# EAGLE board Sequencer-Logic-Prod-V2.0 (EAGLE 9.6.2), part 1 of 2
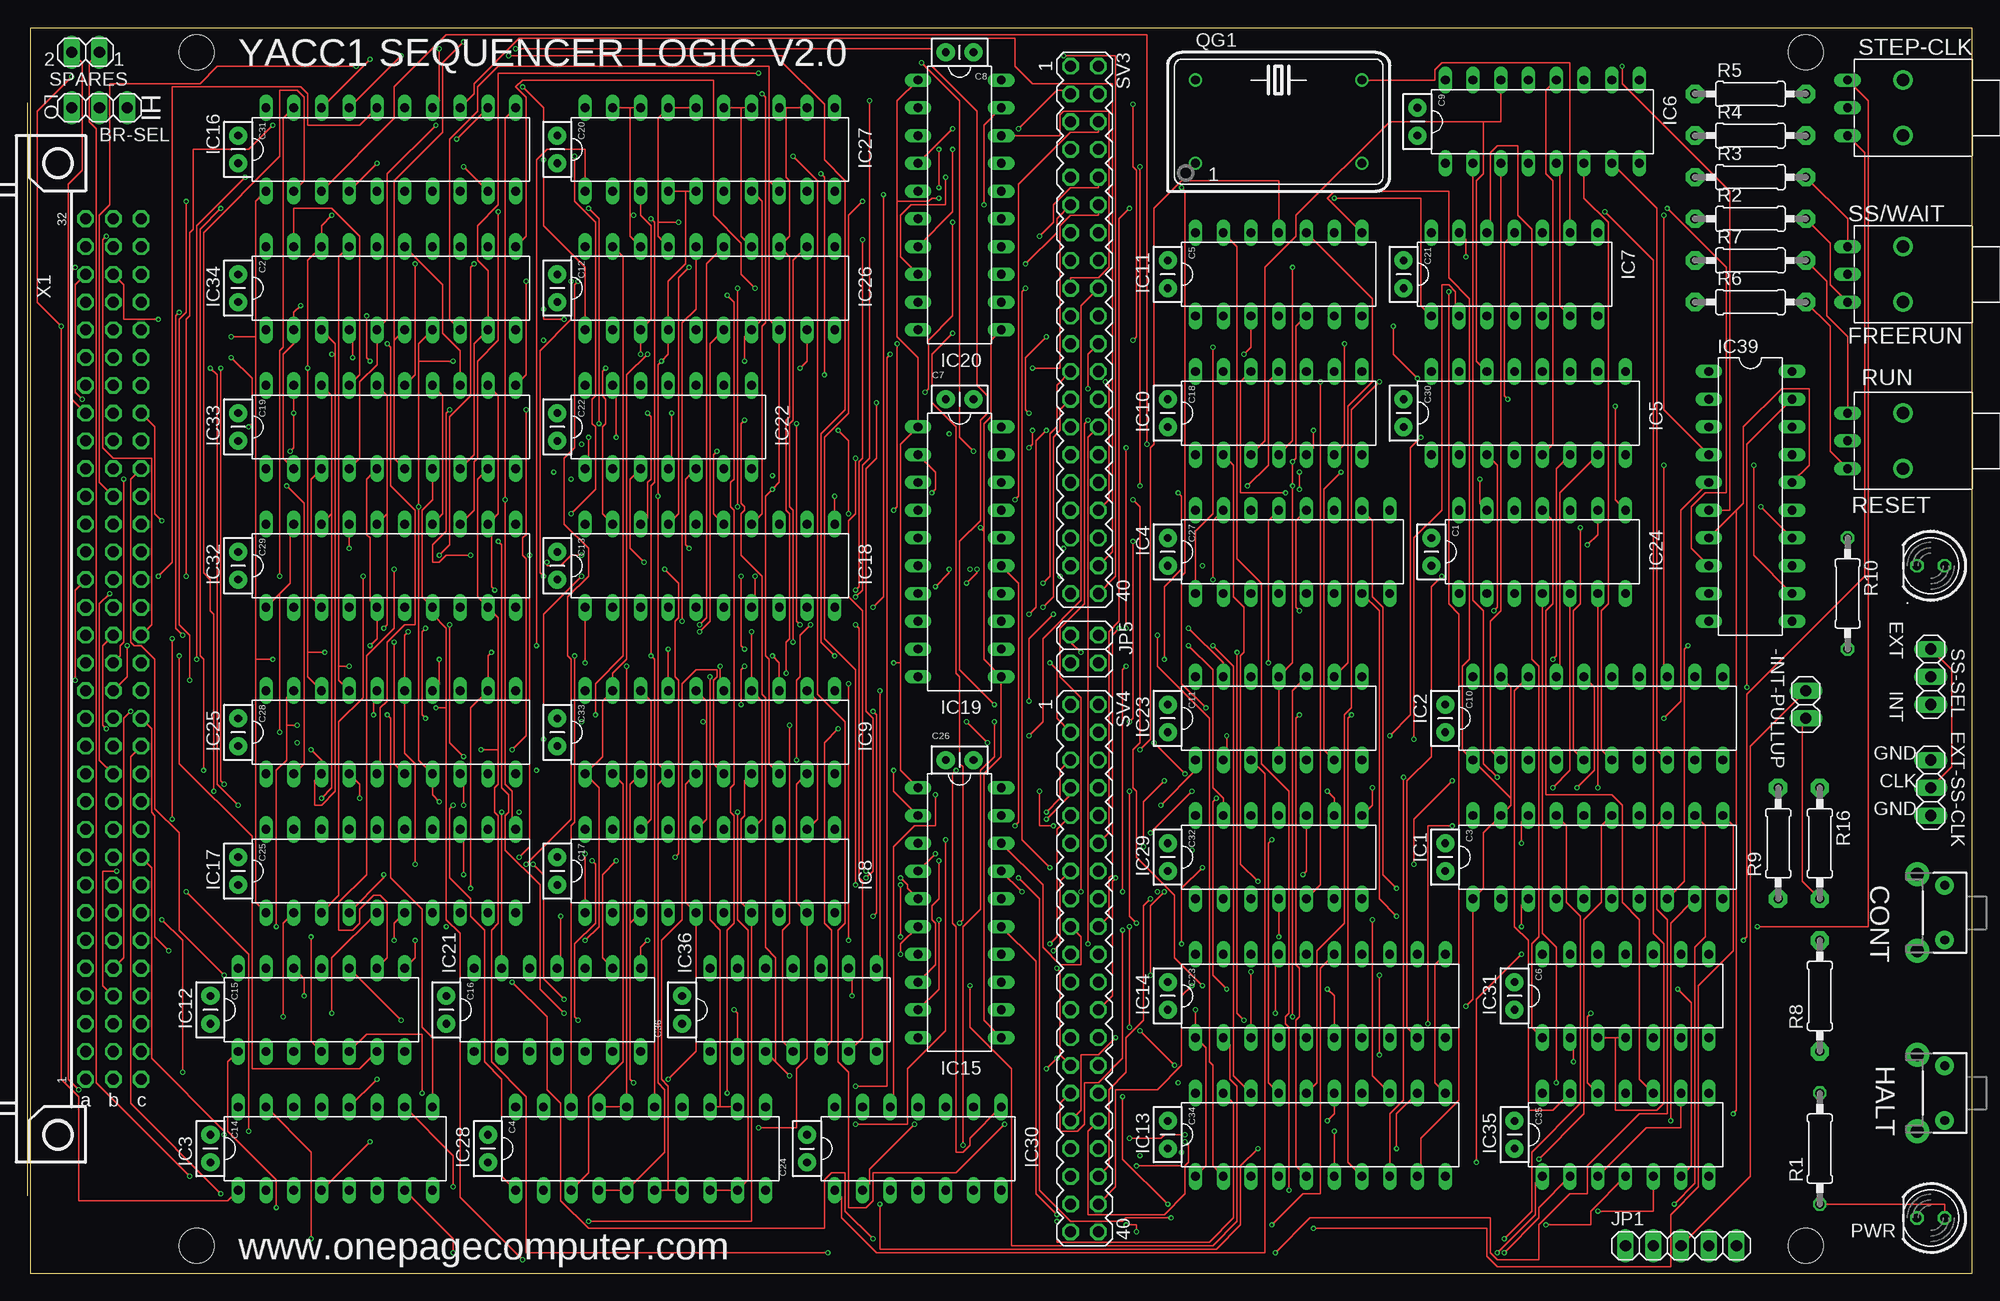
[diagram p9: board, top side]
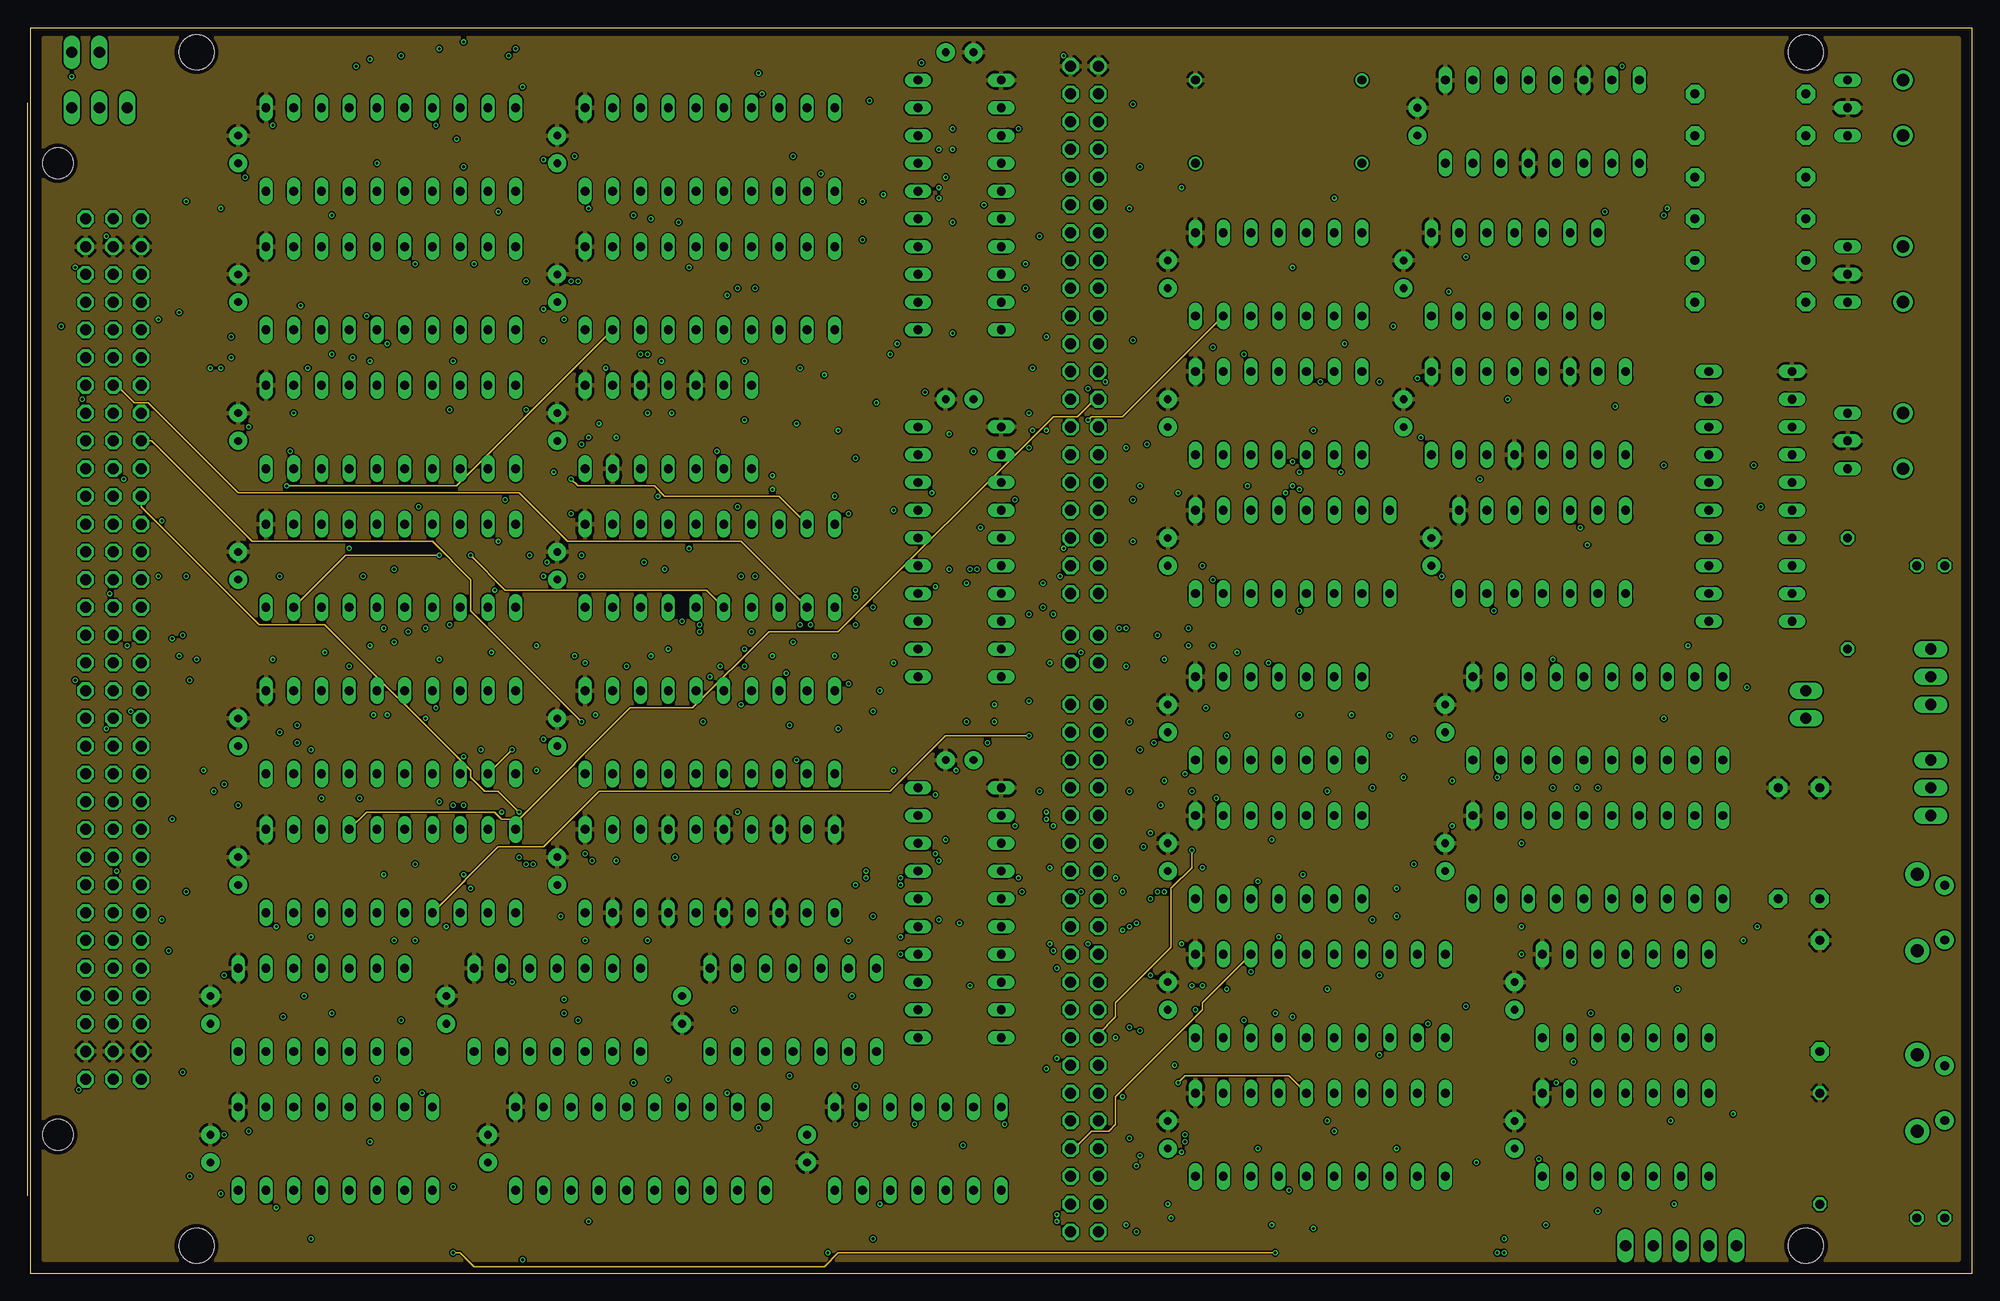
[diagram p10: board, inner layer Route2]
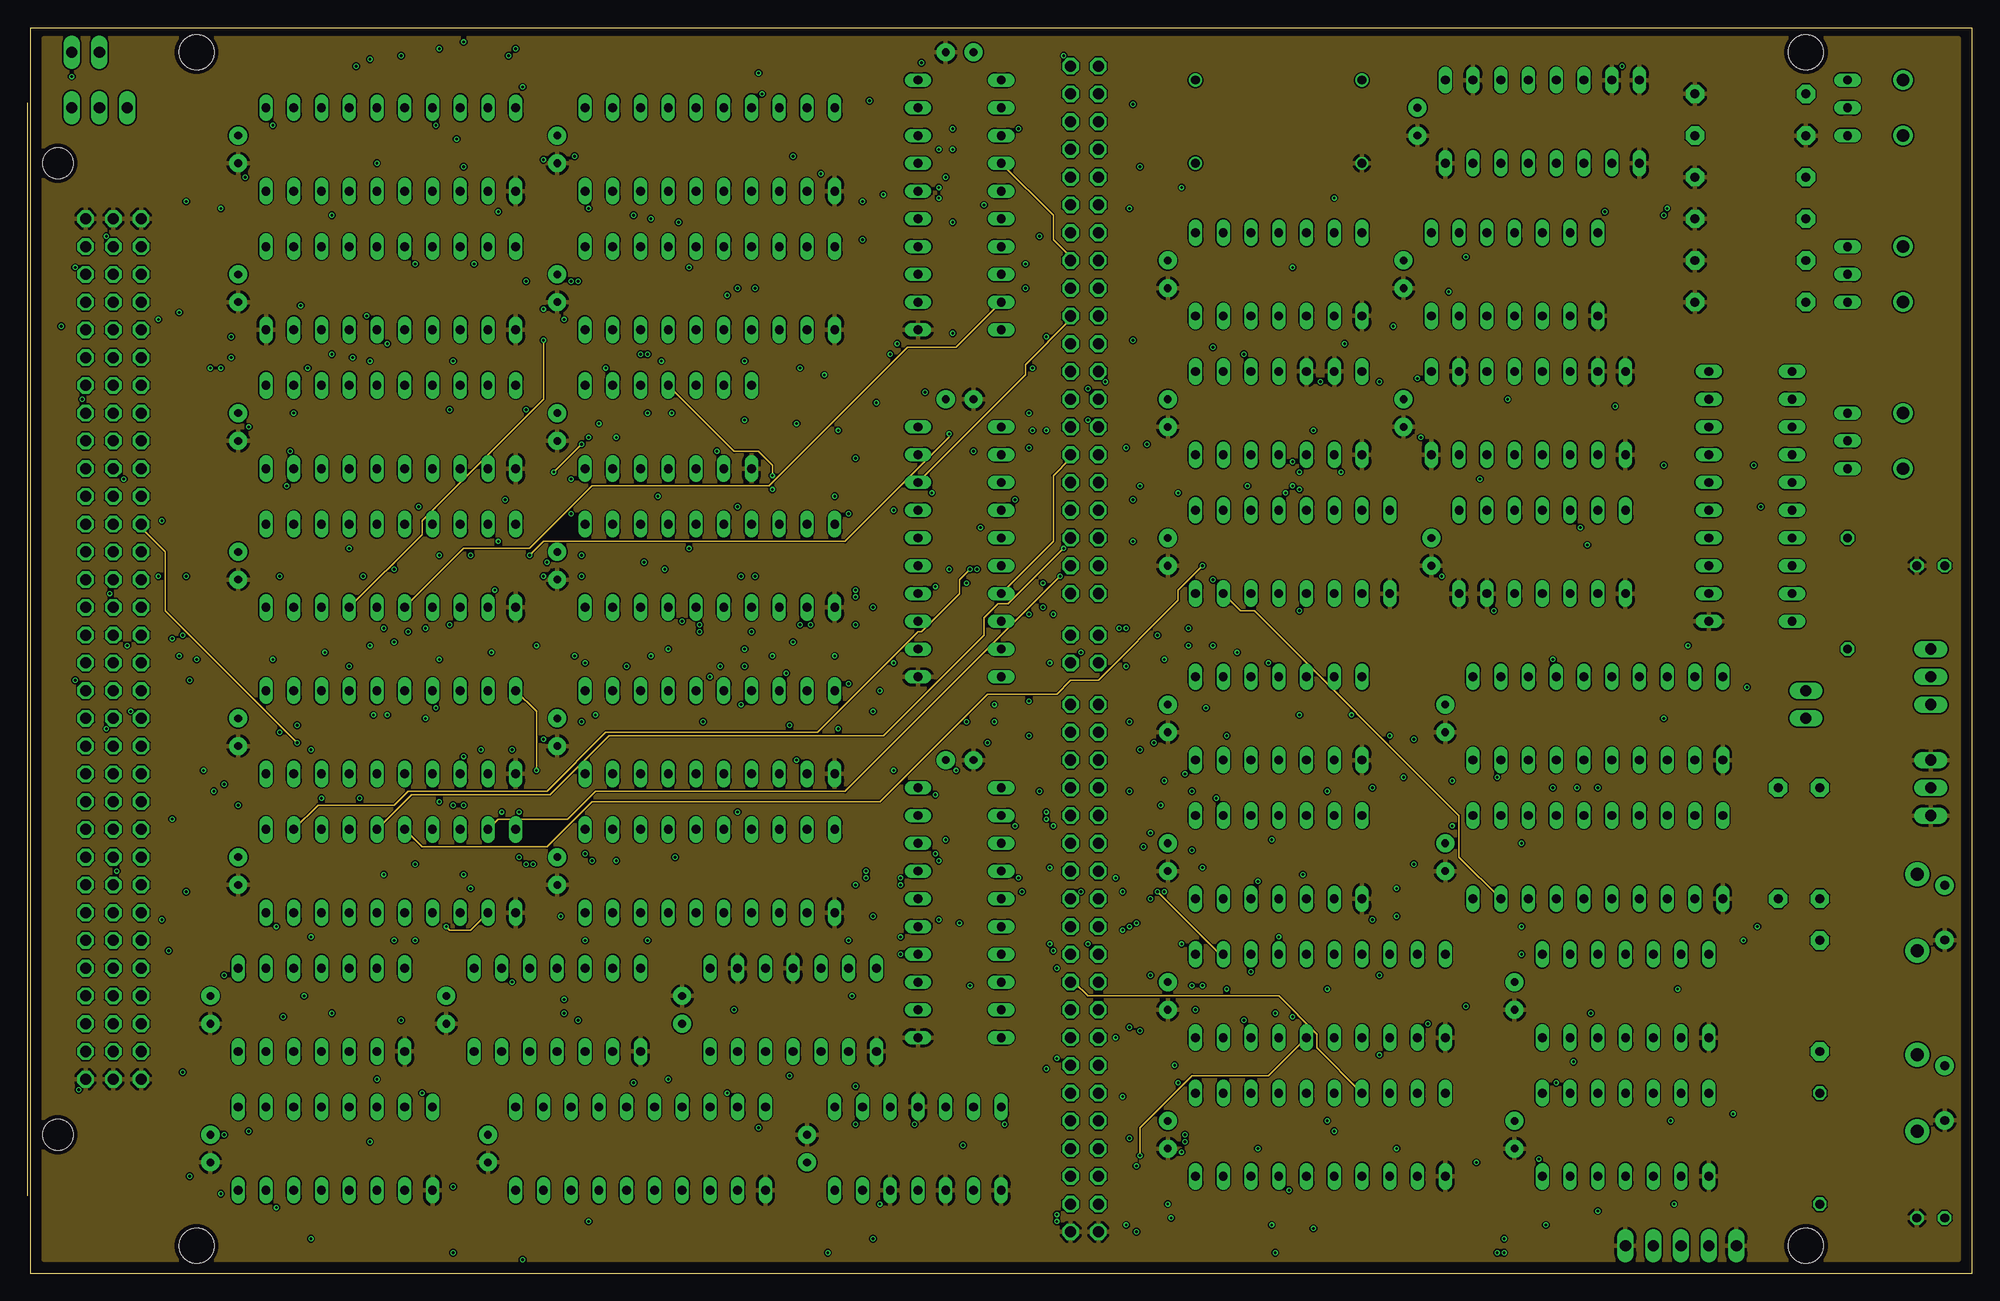
[diagram p11: board, inner layer Route15]
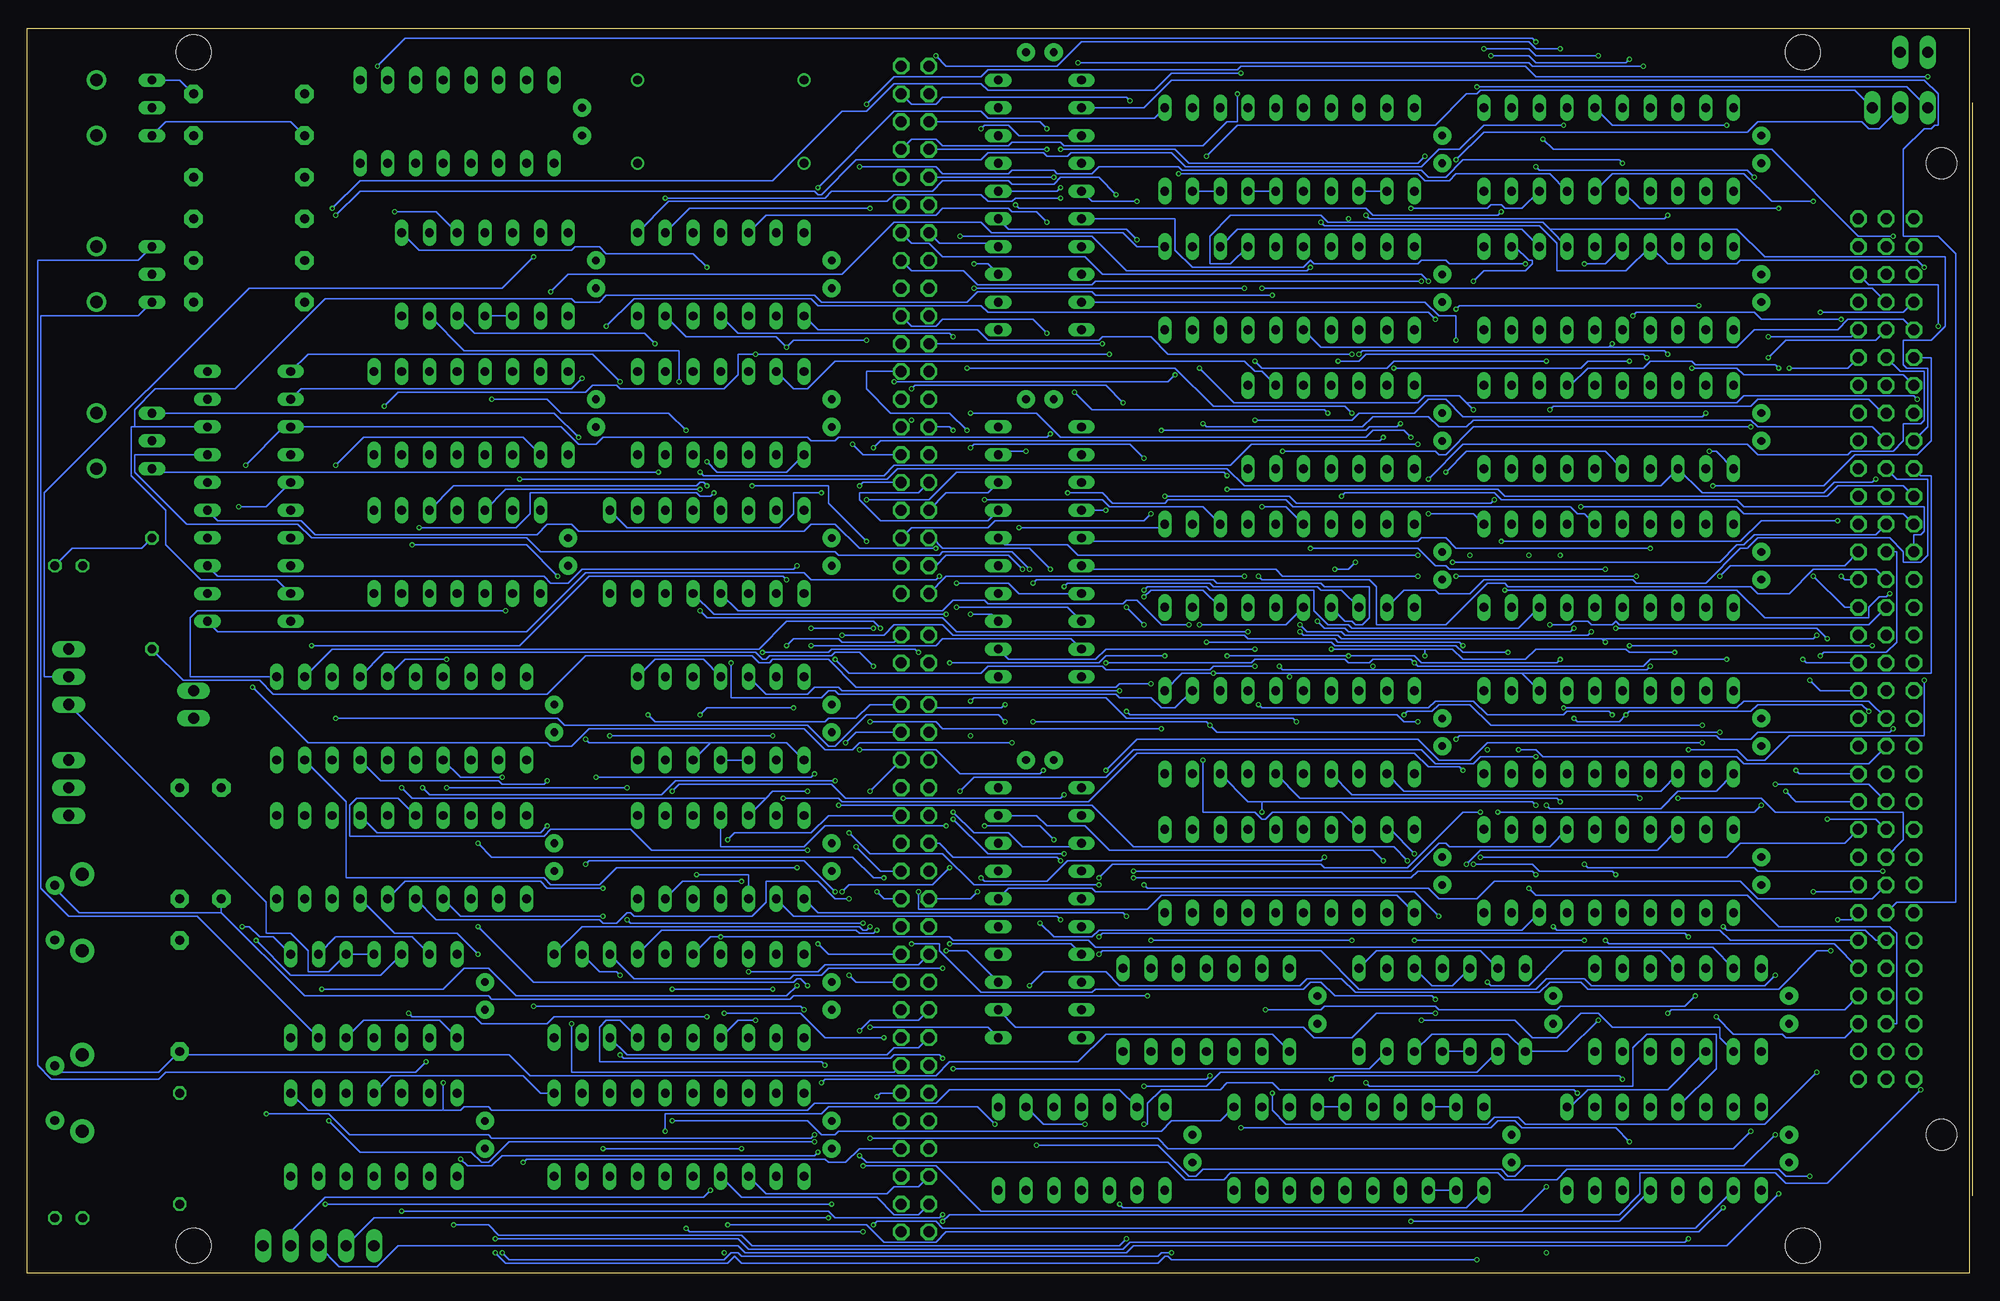
[diagram p12: board, bottom side, seen from below]

Size 177.78 x 113.97 mm. Coordinates in mm from the lower left corner, seen from the top.
Outline: 0,0 177.78,0 177.78,113.97 0,113.97 0,0
Copper layers (1*2*15*16): Top 0.035559375mm / dielectric 0.17018125mm / Route2 0.01778125mm / dielectric 47mil / Route15 0.01778125mm / dielectric 0.17018125mm / Bottom 0.035559375mm
Design rules "oshpark-4layer": minimum track width 5mil, minimum drill 10mil, track to track 5mil, track to pad 5mil, pad to pad 5mil, via to via 5mil, smd to smd 5mil, copper to edge 15mil, drill to drill 6mil, minimum pad ring 4mil, minimum via ring 4mil, stop-mask expansion 2.5mil, vias tented up to drill 0mil, thermal gap 10mil
Holes 3.2 mm at 15.24,111.76 15.24,2.54 162.56,2.54 162.56,111.76

## Footprints (pad centres in the part's own frame; a part is rotated, then mirrored left to right if it is on the bottom)
1X02 = drill 1.016 long: 1 -1.27,0; 2 1.27,0
LED5MM = drill 0.813 octagon: A -1.27,0; K 1.27,0
1X03 = drill 1.016 long: 1 -2.54,0; 2 0,0; 3 2.54,0
CAP-PTH-SMALLEZ = drill 0.7 pad 1.651: 1 0,0; 2 2.54,0
TACTILE-PTH-SIDEEZ = drill 0.8 pad 1.7: 1 -2.5,0; 2 2.5,0 | drill 1.2 pad 2.2: ANCHOR1 -3.5,2.5; ANCHOR2 3.5,2.5
DIL20 = drill 0.813 long: 1 -11.43,-3.81; 2 -8.89,-3.81; 3 -6.35,-3.81; 4 -3.81,-3.81; 5 -1.27,-3.81; 6 1.27,-3.81; 7 3.81,-3.81; 8 6.35,-3.81; 9 8.89,-3.81; 10 11.43,-3.81; 11 11.43,3.81; 12 8.89,3.81; 13 6.35,3.81; 14 3.81,3.81; 15 1.27,3.81; 16 -1.27,3.81; 17 -3.81,3.81; 18 -6.35,3.81; 19 -8.89,3.81; 20 -11.43,3.81
DIL16 = drill 0.813 long: 1 -8.89,-3.81; 2 -6.35,-3.81; 3 -3.81,-3.81; 4 -1.27,-3.81; 5 1.27,-3.81; 6 3.81,-3.81; 7 6.35,-3.81; 8 8.89,-3.81; 9 8.89,3.81; 10 6.35,3.81; 11 3.81,3.81; 12 1.27,3.81; 13 -1.27,3.81; 14 -3.81,3.81; 15 -6.35,3.81; 16 -8.89,3.81
DIL14 = drill 0.813 long: 1 -7.62,-3.81; 2 -5.08,-3.81; 3 -2.54,-3.81; 4 0,-3.81; 5 2.54,-3.81; 6 5.08,-3.81; 7 7.62,-3.81; 8 7.62,3.81; 9 5.08,3.81; 10 2.54,3.81; 11 0,3.81; 12 -2.54,3.81; 13 -5.08,3.81; 14 -7.62,3.81
1X05 = drill 1.016 long: 1 -5.08,0; 2 -2.54,0; 3 0,0; 4 2.54,0; 5 5.08,0
2X02 = drill 1.016 octagon: 1 -1.27,-1.27; 2 -1.27,1.27; 3 1.27,-1.27; 4 1.27,1.27
DIL14S = drill 0.813: 1 -7.62,-3.81; 7 7.62,-3.81; 8 7.62,3.81; 14 -7.62,3.81
0207/10 = drill 0.813 octagon: 1 -5.08,0; 2 5.08,0
0207/10' = drill 0.813 pad 1.676 octagon: 1 -5.08,0; 2 5.08,0
9070-1W = drill 0.813 long: 1 5.08,-2.54; 2 5.08,0; 3 5.08,2.54 | drill 1.118 pad 1.778: B 0,-2.54; B1 0,2.54
MA20-2 = drill 1.016 octagon: 1 -24.13,-1.27; 2 -24.13,1.27; 3 -21.59,-1.27; 4 -21.59,1.27; 5 -19.05,-1.27; 6 -19.05,1.27; 7 -16.51,-1.27; 8 -16.51,1.27; 9 -13.97,-1.27; 10 -13.97,1.27; 11 -11.43,-1.27; 12 -11.43,1.27; 13 -8.89,-1.27; 14 -8.89,1.27; 15 -6.35,-1.27; 16 -6.35,1.27; 17 -3.81,-1.27; 18 -3.81,1.27; 19 -1.27,-1.27; 20 -1.27,1.27; 21 1.27,-1.27; 22 1.27,1.27; 23 3.81,-1.27; 24 3.81,1.27; 25 6.35,-1.27; 26 6.35,1.27; 27 8.89,-1.27; 28 8.89,1.27; 29 11.43,-1.27; 30 11.43,1.27; 31 13.97,-1.27; 32 13.97,1.27; 33 16.51,-1.27; 34 16.51,1.27; 35 19.05,-1.27; 36 19.05,1.27; 37 21.59,-1.27; 38 21.59,1.27; 39 24.13,-1.27; 40 24.13,1.27
FABC96R = drill 1.016 octagon: A1 -2.54,39.37; A2 -2.54,36.83; A3 -2.54,34.29; A4 -2.54,31.75; A5 -2.54,29.21; A6 -2.54,26.67; A7 -2.54,24.13; A8 -2.54,21.59; A9 -2.54,19.05; A10 -2.54,16.51; A11 -2.54,13.97; A12 -2.54,11.43; A13 -2.54,8.89; A14 -2.54,6.35; A15 -2.54,3.81; A16 -2.54,1.27; A17 -2.54,-1.27; A18 -2.54,-3.81; A19 -2.54,-6.35; A20 -2.54,-8.89; A21 -2.54,-11.43; A22 -2.54,-13.97; A23 -2.54,-16.51; A24 -2.54,-19.05; A25 -2.54,-21.59; A26 -2.54,-24.13; A27 -2.54,-26.67; A28 -2.54,-29.21; A29 -2.54,-31.75; A30 -2.54,-34.29; A31 -2.54,-36.83; A32 -2.54,-39.37; B1 -5.08,39.37; B2 -5.08,36.83; B3 -5.08,34.29; B4 -5.08,31.75; B5 -5.08,29.21; B6 -5.08,26.67; B7 -5.08,24.13; B8 -5.08,21.59; B9 -5.08,19.05; B10 -5.08,16.51; B11 -5.08,13.97; B12 -5.08,11.43; B13 -5.08,8.89; B14 -5.08,6.35; B15 -5.08,3.81; B16 -5.08,1.27; B17 -5.08,-1.27; B18 -5.08,-3.81; B19 -5.08,-6.35; B20 -5.08,-8.89; B21 -5.08,-11.43; B22 -5.08,-13.97; B23 -5.08,-16.51; B24 -5.08,-19.05; B25 -5.08,-21.59; B26 -5.08,-24.13; B27 -5.08,-26.67; B28 -5.08,-29.21; B29 -5.08,-31.75; B30 -5.08,-34.29; B31 -5.08,-36.83; B32 -5.08,-39.37; C1 -7.62,39.37; C2 -7.62,36.83; C3 -7.62,34.29; C4 -7.62,31.75; C5 -7.62,29.21; C6 -7.62,26.67; C7 -7.62,24.13; C8 -7.62,21.59; C9 -7.62,19.05; C10 -7.62,16.51; C11 -7.62,13.97; C12 -7.62,11.43; C13 -7.62,8.89; C14 -7.62,6.35; C15 -7.62,3.81; C16 -7.62,1.27; C17 -7.62,-1.27; C18 -7.62,-3.81; C19 -7.62,-6.35; C20 -7.62,-8.89; C21 -7.62,-11.43; C22 -7.62,-13.97; C23 -7.62,-16.51; C24 -7.62,-19.05; C25 -7.62,-21.59; C26 -7.62,-24.13; C27 -7.62,-26.67; C28 -7.62,-29.21; C29 -7.62,-31.75; C30 -7.62,-34.29; C31 -7.62,-36.83; C32 -7.62,-39.37 | hole 2.794: 0,-44.456; 0,44.456

## Placement (x,y rotation side)
-INT-PULLUP  [1X02]  162.56,52.07 90 top
.  OUT  [LED5MM]  173.99,64.77 180 top
BR-SEL  [1X03]  6.35,106.68 180 top
C1  .1  [CAP-PTH-SMALLEZ]  128.27,67.31 270 top
C2  .1  [CAP-PTH-SMALLEZ]  19.05,91.44 270 top
C3  .1  [CAP-PTH-SMALLEZ]  129.54,39.37 270 top
C4  .1  [CAP-PTH-SMALLEZ]  41.91,12.7 270 top
C5  .1  [CAP-PTH-SMALLEZ]  104.14,92.71 270 top
C6  .1  [CAP-PTH-SMALLEZ]  135.89,26.67 270 top
C7  .1  [CAP-PTH-SMALLEZ]  83.82,80.01 0 top
C8  .1  [CAP-PTH-SMALLEZ]  86.36,111.76 180 top
C9  .1  [CAP-PTH-SMALLEZ]  127,106.68 270 top
C10  .1  [CAP-PTH-SMALLEZ]  129.54,52.07 270 top
C11  .1  [CAP-PTH-SMALLEZ]  104.14,52.07 270 top
C12  .1  [CAP-PTH-SMALLEZ]  48.26,91.44 270 top
C13  .1  [CAP-PTH-SMALLEZ]  48.26,66.04 270 top
C14  .1  [CAP-PTH-SMALLEZ]  16.51,12.7 270 top
C15  .1  [CAP-PTH-SMALLEZ]  16.51,25.4 270 top
C16  .1  [CAP-PTH-SMALLEZ]  38.1,25.4 270 top
C17  .1  [CAP-PTH-SMALLEZ]  48.26,38.1 270 top
C18  .1  [CAP-PTH-SMALLEZ]  104.14,80.01 270 top
C19  .1  [CAP-PTH-SMALLEZ]  19.05,78.74 270 top
C20  .1  [CAP-PTH-SMALLEZ]  48.26,104.14 270 top
C21  .1  [CAP-PTH-SMALLEZ]  125.73,92.71 270 top
C22  .1  [CAP-PTH-SMALLEZ]  48.26,78.74 270 top
C23  .1  [CAP-PTH-SMALLEZ]  104.14,26.67 270 top
C24  .1  [CAP-PTH-SMALLEZ]  71.12,10.16 90 top
C25  .1  [CAP-PTH-SMALLEZ]  19.05,38.1 270 top
C26  .1  [CAP-PTH-SMALLEZ]  83.82,46.99 0 top
C27  .1  [CAP-PTH-SMALLEZ]  104.14,67.31 270 top
C28  .1  [CAP-PTH-SMALLEZ]  19.05,50.8 270 top
C29  .1  [CAP-PTH-SMALLEZ]  19.05,66.04 270 top
C30  .1  [CAP-PTH-SMALLEZ]  125.73,80.01 270 top
C31  .1  [CAP-PTH-SMALLEZ]  19.05,104.14 270 top
C32  .1  [CAP-PTH-SMALLEZ]  104.14,39.37 270 top
C33  .1  [CAP-PTH-SMALLEZ]  48.26,50.8 270 top
C34  .1  [CAP-PTH-SMALLEZ]  104.14,13.97 270 top
C35  .1  [CAP-PTH-SMALLEZ]  135.89,13.97 270 top
C36  .1  [CAP-PTH-SMALLEZ]  59.69,22.86 90 top
CONT  SWITCH-MOMENTARY-2SIDE_EZ  [TACTILE-PTH-SIDEEZ]  175.26,33.02 90 top
EXT-SS-CLK  [1X03]  173.99,44.45 270 top
HALT  SWITCH-MOMENTARY-2SIDE_EZ  [TACTILE-PTH-SIDEEZ]  175.26,16.51 90 top
IC1  74LS244N  [DIL20]  143.51,38.1 0 top
IC2  74LS244N  [DIL20]  143.51,50.8 0 top
IC3  74LS175N  [DIL16]  27.94,11.43 0 top
IC4  74LS175N  [DIL16]  115.57,66.04 0 top
IC5  74LS192N  [DIL16]  137.16,78.74 0 top
IC6  74LS192N  [DIL16]  138.43,105.41 0 top
IC7  74LS08N  [DIL14]  135.89,91.44 0 top
IC8  74LS244N  [DIL20]  62.23,36.83 0 top
IC9  74LS244N  [DIL20]  62.23,49.53 0 top
IC10  74LS32N  [DIL14]  114.3,78.74 0 top
IC11  74LS04N  [DIL14]  114.3,91.44 0 top
IC12  74LS08N  [DIL14]  26.67,24.13 0 top
IC13  74LS374N  [DIL20]  118.11,12.7 0 top
IC14  74LS374N  [DIL20]  118.11,25.4 0 top
IC15  74LS374N  [DIL20]  85.09,33.02 270 top
IC16  74LS374N  [DIL20]  33.02,102.87 0 top
IC17  74LS374N  [DIL20]  33.02,36.83 0 top
IC18  74LS374N  [DIL20]  62.23,64.77 0 top
IC19  74LS374N  [DIL20]  85.09,66.04 270 top
IC20  74LS374N  [DIL20]  85.09,97.79 270 top
IC21  74ALS02N  [DIL14]  48.26,24.13 0 top
IC22  74LS74N  [DIL14]  58.42,77.47 0 top
IC23  74ALS02N  [DIL14]  114.3,50.8 0 top
IC24  74LS32N  [DIL14]  138.43,66.04 0 top
IC25  74LS374N  [DIL20]  33.02,49.53 0 top
IC26  74LS374N  [DIL20]  62.23,90.17 0 top
IC27  74LS374N  [DIL20]  62.23,102.87 0 top
IC28  74LS374N  [DIL20]  55.88,11.43 0 top
IC29  74LS08N  [DIL14]  114.3,38.1 0 top
IC30  74LS04N  [DIL14]  81.28,11.43 0 top
IC31  74ALS02N  [DIL14]  146.05,25.4 0 top
IC32  74LS244N  [DIL20]  33.02,64.77 0 top
IC33  74LS244N  [DIL20]  33.02,77.47 0 top
IC34  74LS374N  [DIL20]  33.02,90.17 0 top
IC35  74LS32N  [DIL14]  146.05,12.7 0 top
IC36  74LS04N  [DIL14]  69.85,24.13 0 top
IC39  74LS244N  [DIL20]  157.48,71.12 270 top
JP1  [1X05]  151.13,2.54 0 top
JP5  [2X02]  96.52,57.15 270 top
PWR  [LED5MM]  173.99,5.08 180 top
QG1  [DIL14S]  114.3,105.41 0 top
R1  330  [0207/10]  163.83,11.43 90 top
R2  10k  [0207/10']  157.48,96.52 180 top
R3  10k  [0207/10']  157.48,100.33 0 top
R4  10k  [0207/10']  157.48,104.14 0 top
R5  10k  [0207/10']  157.48,107.95 0 top
R6  10k  [0207/10']  157.48,88.9 180 top
R7  10k  [0207/10']  157.48,92.71 0 top
R8  10k  [0207/10']  163.83,25.4 90 top
R9  10k  [0207/10']  160.02,39.37 90 top
R10  330  [0207/10]  166.37,62.23 270 top
R16  10k  [0207/10']  163.83,39.37 270 top
RESET  [9070-1W]  171.45,76.2 180 top
SPARES  [1X02]  5.08,111.76 180 top
SS-SEL  [1X03]  173.99,54.61 90 top
SS/WAIT  [9070-1W]  171.45,91.44 180 top
STEP-CLK  [9070-1W]  171.45,106.68 180 top
SV3  [MA20-2]  96.52,86.36 270 top
SV4  [MA20-2]  96.52,27.94 270 top
X1  FABC96R  [FABC96R]  2.54,57.15 180 top

## Tracks (layer width: path | path; a pad name or v marks a point on that pad's centre or on a via)
-2-BYTE-OPERAND-SEL  (via drill 0.25)
  Top 0.127: v23.81,75.25 24.13,75.56 v24.13,78.74 IC33.19 | v69.53,18.1 68.26,19.37 | 68.26,19.37 IC36.3 | v123.51,81.6 120.97,79.06 120.97,51.75 120.33,51.12 120.33,32.07 117.79,29.53 117.79,17.46 IC13.16 | v65.41,78.11 65.09,77.79 65.09,70.48 65.41,70.17 65.41,69.85 65.09,69.53 65.09,65.72 66.99,63.82 66.99,53.02 67.31,52.7 67.31,29.84 68.26,28.89 68.26,19.37
  Route2 0.127: v105.09,17.46 105.73,18.1 115.25,18.1 IC13.16
  Bottom 0.127: IC33.1 23.18,75.25 v23.81,75.25 | v69.53,18.1 69.85,17.78 104.78,17.78 v105.09,17.46 | IC39.1 152.08,84.14 126.05,84.14 v123.51,81.6 | v24.13,78.74 24.45,78.42 46.35,78.42 47.94,80.01 49.53,80.01 50.8,78.74 55.88,78.74 56.52,78.11 v65.41,78.11
-AC-LD  (via drill 0.25)
  Top 0.127: IC15.5 80.33,35.24 80.33,35.56 v79.69,36.2
  Route2 0.127: v44.77,42.23 42.86,44.13 41.59,44.13 40.32,45.4 40.32,46.04 26.99,59.37 20.95,59.37 10.16,70.17 X1.C22
  Bottom 0.127: v79.69,36.2 78.42,37.47 59.37,37.47 59.05,37.15 51.44,37.15 46.35,42.23 v44.77,42.23
-AC-LD-INV  (via drill 0.25)
  Top 0.127: IC16.19 23.18,105.73 23.18,84.77 22.86,84.45 v22.86,63.82
  Bottom 0.127: v22.86,63.82 21.91,64.77 11.43,64.77 X1.C20
-AC-RD  (via drill 0.25)
  Top 0.127: IC15.2 79.06,44.13 v79.06,46.04
  Route15 0.127: v24.45,48.58 12.38,60.64 12.38,66.04 10.16,68.26 X1.C21
  Bottom 0.127: v79.06,46.04 76.2,48.9 50.48,48.9 48.58,46.99 45.72,46.99 44.13,48.58 v24.45,48.58
-ADDR-REG-LD0  (via drill 0.25)
  Top 0.127: IC17.5 27.62,28.89 v27.62,23.81
  Bottom 0.127: v27.62,23.81 27.3,24.13 11.43,24.13 X1.C4
-ADDR-REG-LD1  (via drill 0.25)
  Route15 0.127: IC17.9 40.32,31.43 38.42,31.43 v38.1,31.75
  Bottom 0.127: v38.1,31.75 37.78,31.43 22.86,31.43 21.91,30.48 X1.C6
-ADDR-REG-RD0  (via drill 0.25)
  Top 0.127: IC17.2 23.18,32.07 v23.18,23.5
  Bottom 0.127: v23.18,23.5 21.59,21.91 17.14,21.91 16.83,21.59 11.43,21.59 X1.C3
-ADDR-REG-RD1  (via drill 0.25)
  Top 0.127: IC17.6 33.34,32.07 v33.34,30.48
  Bottom 0.127: v33.34,30.48 33.02,30.16 12.38,30.16 X1.C5
-ALU-FUNC  (via drill 0.25)
  Top 0.127: v14.29,98.11 14.29,87.95 13.65,87.31 13.65,59.37 14.61,58.42 v14.61,54.29
  Bottom 0.127: IC16.6 32.7,100.65 20.64,100.65 18.1,98.11 v14.29,98.11 | v14.61,54.29 13.65,53.34 X1.C15
-BRANCH-HI-SELECTED  (via drill 0.25)
  Top 0.127: IC26.1 50.8,92.08 46.99,95.89 v46.99,101.92
  Bottom 0.127: v46.99,101.92 44.45,104.46 20.32,104.46 19.37,105.41 9.84,105.41 9.21,104.78 8.26,104.78 BR-SEL.2
-BRANCH-RD-HI  (via drill 0.25)
  Top 0.127: v119.38,13.02 IC13.6 | v89.22,13.65 84.77,9.21 77.15,9.21 77.15,6.67 76.52,6.03 74.93,6.03 74.93,18.41 73.98,19.37 73.98,31.43 74.61,32.07 74.61,50.48 72.07,53.02 72.07,100.01 v69.85,102.23
  Bottom 0.127: v119.38,13.02 119.38,14.61 105.09,14.61 104.46,15.24 90.81,15.24 v89.22,13.65 | v69.85,102.23 66.99,105.09 48.9,105.09 46.04,107.95 45.09,107.95 44.77,108.27 10.48,108.27 BR-SEL.1
-BRANCH-RD-LO  (via drill 0.25)
  Top 0.127: IC13.2 108.27,9.84 108.27,19.05 107.95,19.37 107.95,50.8 103.19,55.56 v103.19,58.42 | v46.35,57.47 46.35,101.92 46.99,102.55 | 46.99,102.55 47.31,102.87 50.8,102.87 IC27.1 | v45.09,108.58 46.99,106.68 46.99,102.55
  Bottom 0.127: v103.19,58.42 99.38,58.42 98.42,59.37 93.98,59.37 93.03,58.42 66.36,58.42 66.04,58.1 58.1,58.1 57.78,57.78 46.67,57.78 v46.35,57.47 | BR-SEL.3 5.71,108.58 v45.09,108.58
-BUS-EN  (via drill 0.25)
  Top 0.127: IC11.8 118.75,98.42 119.38,99.06 129.86,99.06 129.86,91.12 131.76,89.22 131.76,56.2 131.13,55.56 131.13,47.94 IC2.1 135.57,43.5 | IC13.1 107.63,9.84 107.63,20.64 IC14.1 v106.68,24.13 | IC2.19 135.57,53.66 135.57,43.5 | 135.57,43.5 135.57,42.86 IC1.19 133.03,40.32 133.03,35.24 IC1.1 132.08,25.08 v131.44,24.45 | IC15.1 79.69,46.04 79.69,55.88 | 79.69,55.88 79.69,75.88 IC19.1 81.28,83.82 79.38,85.72 79.38,98.11 | IC20.1 79.38,107.31 79.38,98.11 | IC17.1 20.64,33.97 20.64,56.2 | 20.64,85.72 20.64,98.11 IC16.1 | 20.64,85.72 20.64,56.2 | v50.8,55.88 IC18.1 | 20.64,56.2 v22.23,56.2 | 20.64,85.72 v18.41,85.72 | v79.06,55.88 79.69,55.88 | v83.19,98.42 82.55,98.42 82.23,98.11 79.38,98.11
  Bottom 0.127: v106.68,24.13 107,24.45 v131.44,24.45 | v22.23,56.2 29.21,56.2 29.84,55.56 50.48,55.56 v50.8,55.88 51.12,56.2 54.61,56.2 54.93,55.88 56.83,55.88 57.15,56.2 65.41,56.2 65.72,55.88 v79.06,55.88 | X1.C28 10.79,85.72 v18.41,85.72 | IC11.8 119.06,98.11 99.06,98.11 98.42,98.74 90.49,98.74 89.85,98.11 87.63,98.11 87.31,98.42 v83.19,98.42
-DO-INT  (via drill 0.25)
  Top 0.127: v50.8,38.42 IC8.1 | v96.84,78.11 96.52,77.79 96.52,61.28 94.3,59.05 94.3,54.61 96.2,52.7 v96.2,34.92
  Route2 0.127: IC11.2 100.01,78.42 97.16,78.42 v96.84,78.11
  Bottom 0.127: v50.8,38.42 53.02,40.64 IC8.19 | v96.2,34.92 96.2,33.34 75.25,33.34 73.98,34.61 52.39,34.61 IC8.1
-FP-HALT
  Bottom 0.127: IC36.1 63.82,21.91 79.06,21.91 81.6,19.37 93.34,19.37 94.61,18.1 131.76,18.1 133.67,20 163.51,20 R8.1 165.74,18.41 174.94,18.41 175.26,18.73 HALT.2
-HALT-CONT  (via drill 0.25)
  Top 0.127: IC36.9 75.25,27.62 v75.25,25.4
  Bottom 0.127: v75.25,25.4 107.63,25.4 107.95,25.08 135.25,25.08 135.57,25.4 152.4,25.4 160.02,33.02 | R9.1 160.02,33.02 | 160.02,33.02 173.04,33.02 175.26,35.24 CONT.2
-HL-SWAP  (via drill 0.25)
  Top 0.127: v48.9,23.81 46.67,26.04 46.67,35.56 43.5,38.73 43.5,41.91 43.81,42.23 43.81,43.81 43.18,44.45 43.18,66.67 v42.86,66.99 | v12.06,68.9 11.43,69.53 11.43,77.47 X1.C25
  Bottom 0.127: IC15.12 87.31,22.54 60.96,22.54 60.01,21.59 56.52,21.59 54.29,23.81 v48.9,23.81 | v42.86,66.99 20.95,66.99 19.05,68.9 v12.06,68.9
-INT  (via drill 0.25)
  Top 0.127: X1.C13 9.21,47.31 9.21,15.56 v17.46,7.3 | -INT-PULLUP.2 157.48,48.26 157.48,8.89 JP1.3
  Bottom 0.127: v17.46,7.3 22.23,2.54 76.52,2.54 77.15,1.91 112.08,1.91 112.71,2.54 143.83,2.54 145.73,0.64 149.22,0.64 JP1.3
-INT-JMP  (via drill 0.25)
  Top 0.127: IC28.1 43.18,8.89 43.18,17.78 41.59,19.37 41.59,31.43 40.32,32.7 40.32,34.29 38.42,36.2 38.42,42.55 v38.73,42.86 | IC13.12 125.09,14.61 v125.09,11.43 | v112.39,11.43 110.81,9.84 110.81,4.45 108.58,2.22 77.79,2.22 v77.79,6.35
  Bottom 0.127: v38.73,42.86 38.42,42.55 28.26,42.55 26.67,44.13 23.18,44.13 IC25.1 | v112.39,11.43 v125.09,11.43 | v77.79,6.35 77.47,6.03 46.04,6.03 IC28.1
-INTA  (via drill 0.25)
  Top 0.127: IC14.2 109.86,20.95 109.86,17.78 110.49,17.14 110.49,4.76 108.27,2.54 89.85,2.54 89.85,18.73 86.04,22.54 v86.04,26.35 | v12.7,29.53 11.43,30.8 11.43,41.91 11.11,42.23 11.11,49.85 X1.C14
  Bottom 0.127: v86.04,26.35 84.77,27.62 79.06,27.62 77.79,26.35 61.28,26.35 60.64,26.99 57.47,26.99 56.2,25.72 39.37,25.72 38.42,26.67 35.56,26.67 34.92,26.04 17.46,26.04 13.97,29.53 v12.7,29.53
-IO-ADDR-LD  (via drill 0.25)
  Top 0.127: IC16.2 25.08,100.01 25.08,107.63 24.45,108.27 22.86,108.27 22.86,102.23 15.88,95.25 15.88,64.14 16.51,63.5 16.51,60.64 16.83,60.33 v16.83,44.13
  Bottom 0.127: v16.83,44.13 15.88,43.18 X1.C11
-IO-RD  (via drill 0.25)
  Top 0.127: v40.32,65.72 38.1,65.72 37.47,65.09 36.83,65.09 36.83,66.67 38.1,67.94 38.1,78.74 v38.42,79.06
  Route2 0.127: IC18.6 61.91,62.55 43.5,62.55 v40.32,65.72
  Bottom 0.127: v38.42,79.06 38.1,79.38 20,79.38 19.37,80.01 9.21,80.01 7.94,78.74 X1.B25
-IO-WR
  Route2 0.127: IC18.9 65.09,66.99 49.21,66.99 44.77,71.44 19.05,71.44 10.79,79.69 9.53,79.69 7.94,81.28 X1.B26
-MEM-RD
  Bottom 0.127: IC18.2 51.75,62.55 48.9,62.55 48.58,62.23 45.72,62.23 44.45,63.5 30.8,63.5 30.48,63.18 24.13,63.18 20.95,66.36 20.32,66.36 19.37,67.31 7.3,67.31 6.03,66.04 6.03,65.09 4.45,65.09 3.81,65.72 3.81,72.71 6.67,72.71 X1.B23
-MEM-WR  (via drill 0.25)
  Top 0.127: v70.48,59.37 70.17,59.69 v70.17,77.79
  Bottom 0.127: IC18.5 62.55,59.37 v70.48,59.37 | v70.17,77.79 69.85,77.47 55.56,77.47 54.61,78.42 49.53,78.42 48.58,77.47 46.04,77.47 45.4,78.11 20,78.11 19.37,77.47 8.89,77.47 X1.B24
-ONE-OPERAND-SEL  (via drill 0.25)
  Top 0.127: 22.86,62.23 23.81,63.18 23.81,68.26 IC32.19 | 22.86,62.23 IC32.1 | IC36.4 68.9,21.27 68.9,31.43 69.53,32.07 v69.53,50.16 | 22.86,62.23 v22.86,49.53 | IC39.19 157.16,75.88 v157.16,53.66 | v85.72,50.48 v87.63,48.58
  Bottom 0.127: v22.86,49.53 68.9,49.53 v69.53,50.16 69.85,50.48 v85.72,50.48 | v157.16,53.66 152.08,48.58 130.18,48.58 129.86,48.26 127.95,48.26 126.36,49.85 106.68,49.85 104.78,47.94 102.23,47.94 101.6,48.58 v87.63,48.58
-REG-DN  (via drill 0.25)
  Top 0.127: v50.48,65.72 49.53,65.72 48.58,64.77 47.31,64.77 v47.31,65.09
  Bottom 0.127: IC19.16 88.27,66.67 82.55,66.67 81.6,65.72 v50.48,65.72 | v47.31,65.09 22.86,65.09 21.27,66.67 20.64,66.67 19.68,67.63 8.57,67.63 X1.B21
-REG-FUNC-LD  (via drill 0.25)
  Top 0.127: v76.2,98.11 74.93,96.84 74.93,78.74 72.71,76.52 72.71,58.1 75.56,55.24 v75.56,35.56
  Bottom 0.127: IC20.5 80.33,98.11 v76.2,98.11 | v75.56,35.56 75.25,35.24 49.53,35.24 48.58,34.29 45.09,34.29 43.5,35.88 20.95,35.88 19.37,34.29 8.89,34.29 X1.B8
-REG-FUNC-RD
  Bottom 0.127: IC20.2 75.56,106.68 73.03,109.22 4.13,109.22 2.86,107.95 2.86,105.09 3.17,105.09 3.49,104.78 4.13,104.78 6.03,102.87 6.03,94.93 2.86,94.93 1.27,93.34 1.27,33.97 6.67,33.97 X1.B7
-REG-LD-HI  (via drill 0.25)
  Top 0.127: IC12.6 30.16,18.73 20.32,18.73 20.32,40.01 13.65,46.67 v13.65,56.52
  Bottom 0.127: v13.65,56.52 13.34,56.83 7.62,56.83 6.67,57.78 6.67,66.04 X1.B20
-REG-LD-LO  (via drill 0.25)
  Top 0.127: v93.66,40.96 92.39,40.96 v92.39,44.13 | v39.69,47.31 38.42,48.58 v38.42,59.37
  Bottom 0.127: IC29.11 114.3,39.05 106.68,39.05 104.78,40.96 v93.66,40.96 | v92.39,44.13 91.12,45.4 79.06,45.4 76.52,47.94 50.16,47.94 48.9,46.67 45.4,46.67 44.77,47.31 v39.69,47.31 | v38.42,59.37 36.51,59.37 36.2,59.69 34.92,59.69 34.61,59.37 32.7,59.37 32.38,59.69 32.07,59.37 9.21,59.37 X1.B18
-REG-RD-HI  (via drill 0.25)
  Top 0.127: v65.41,57.15 65.09,57.47 v65.09,63.82
  Bottom 0.127: IC19.12 87.95,56.2 80.01,56.2 79.06,57.15 v65.41,57.15 | v65.09,63.82 64.77,63.5 54.93,63.5 54.29,62.87 54.29,59.37 47.94,59.37 44.13,63.18 42.55,63.18 42.23,62.87 20,62.87 19.37,62.23 16.51,62.23 14.29,64.45 8.57,64.45 X1.B19
-REG-RD-LO  (via drill 0.25)
  Top 0.127: v50.48,63.82 46.99,60.33 v46.99,48.9 | v6.99,49.85 6.67,50.16 6.67,57.47 X1.B17
  Bottom 0.127: IC19.6 80.96,64.45 63.5,64.45 62.87,63.82 v50.48,63.82 | v46.99,48.9 46.67,49.21 23.18,49.21 22.86,48.9 20,48.9 19.37,49.53 7.3,49.53 v6.99,49.85
-REG-UP  (via drill 0.25)
  Top 0.127: v86.36,75.25 85.09,76.52 85.09,107.31 v81.6,110.81 | v29.84,110.49 17.14,110.49 15.56,108.9 7.3,108.9 7.3,97.79 6.35,96.84 6.35,72.39 X1.B22
  Bottom 0.127: IC19.19 88.58,75.25 v86.36,75.25 | v81.6,110.81 40.32,110.81 40.01,110.49 v29.84,110.49
-RESET  (via drill 0.25)
  Top 0.127: IC4.1 106.68,67.94 108.27,69.53 v108.27,84.77 | IC3.1 18.1,6.67 4.45,6.67 4.45,16.19 2.86,17.78 v2.86,86.68 0.64,88.9 0.64,106.36 v3.81,109.54 | v100.97,85.41 101.28,85.72 101.28,100.97 100.97,101.28 v100.97,107
  Bottom 0.127: IC11.6 117.47,85.72 109.22,85.72 v108.27,84.77 107.63,85.41 v100.97,85.41 | v2.86,86.68 2.86,90.49 9.21,90.49 X1.C30 | v100.97,107 98.42,109.54 90.49,109.54 89.85,110.17 66.99,110.17 66.67,110.49 40.64,110.49 39.69,109.54 v3.81,109.54
-SR-LD  (via drill 0.25)
  Top 0.127: IC15.6 79.69,30.16 v79.69,29.21 | v17.78,27.3 13.65,31.43 13.65,40.32 11.43,42.55 11.43,56.2 10.16,57.47 9.53,57.47 9.21,57.78 9.21,72.71 X1.C23
  Bottom 0.127: v79.69,29.21 79.38,29.53 59.37,29.53 55.88,26.04 39.69,26.04 38.73,26.99 35.24,26.99 34.61,26.35 18.73,26.35 v17.78,27.3
-TMP-REG-LD0  (via drill 0.25)
  Top 0.127: IC18.15 62.55,69.53 62.55,74.93 v62.87,75.25 | v20,77.47 20.32,77.79 20.32,81.92 v18.41,83.82
  Bottom 0.127: v62.87,75.25 48.9,75.25 48.58,74.93 47.94,74.93 45.4,77.47 v20,77.47 | v18.41,83.82 16.83,85.41 8.57,85.41 X1.B28
-TMP-REG-LD1  (via drill 0.25)
  Top 0.127: IC18.19 52.39,69.53 52.39,77.47 52.7,77.79 52.7,80.01 52.39,80.33 52.39,82.55 v52.7,82.87 | v31.11,83.5 30.8,83.82 v30.8,87.63 | v11.75,87.31 8.57,87.31 8.57,90.49 X1.B30
  Bottom 0.127: v52.7,82.87 35.56,82.87 34.92,83.5 v31.11,83.5 | v30.8,87.63 30.48,87.95 19.68,87.95 19.05,87.31 v11.75,87.31
-TMP-REG-RD0  (via drill 0.25)
  Route2 0.127: IC18.12 68.58,71.12 58.1,71.12 57.15,72.07 50.16,72.07 v49.53,72.71
  Bottom 0.127: v49.53,72.71 46.35,75.88 20.32,75.88 19.37,74.93 11.11,74.93 10.79,75.25 6.99,75.25 6.03,76.2 6.03,77.79 4.45,77.79 4.13,78.11 4.13,82.55 6.35,82.55 X1.B27
-TMP-REG-RD1  (via drill 0.25)
  Top 0.127: v64.77,90.17 v64.77,70.17
  Bottom 0.127: IC18.16 62.55,70.17 v64.77,70.17 | v64.77,90.17 8.89,90.17 X1.B29
-VMA  (via drill 0.25)
  Top 0.127: v17.46,97.47 15.56,95.57 15.56,56.52 15.88,56.2 v15.88,46.04
  Bottom 0.127: IC16.5 30.16,97.47 v17.46,97.47 | v15.88,46.04 15.56,45.72 X1.C12
ALU0  (via drill 0.25)
  Top 0.127: v39.69,101.28 IC16.9 | v19.68,100.33 15.24,95.89 v15.24,56.2
  Bottom 0.127: v39.69,101.28 39.37,100.97 20.32,100.97 v19.68,100.33 | v15.24,56.2 14.92,55.88 X1.C16
ALU1  (via drill 0.25)
  Top 0.127: v39.05,103.82 IC16.12 | v6.99,94.93 6.67,94.61 6.67,75.56 7.62,74.61 11.11,74.61 11.11,59.37 X1.C17
  Bottom 0.127: v39.05,103.82 38.1,102.87 18.1,102.87 10.16,94.93 v6.99,94.93
ALU2  (via drill 0.25)
  Top 0.127: v22.23,105.09 20,102.87 14.92,102.87 14.92,95.57 14.61,95.25 14.61,87.63 14.29,87.31 v14.29,63.82
  Bottom 0.127: IC16.15 32.7,105.09 v22.23,105.09 | v14.29,63.82 11.43,60.96 X1.C18
ALU3  (via drill 0.25)
  Top 0.127: IC16.16 30.16,105.09 25.4,105.09 25.4,107.95 24.77,108.58 13.02,108.58 13.02,65.09 v11.75,63.82
  Bottom 0.127: v11.75,63.82 11.43,63.5 X1.C19
BR-COND  (via drill 0.25)
  Top 0.127: v77.15,32.7 77.47,33.02 77.47,51.12 v77.15,51.44
  Route2 0.127: v50.48,50.48 40.32,60.64 40.32,63.5 36.83,66.99 20.32,66.99 11.11,76.2 X1.C24
  Bottom 0.127: IC29.1 105.41,33.02 77.47,33.02 v77.15,32.7 | v77.15,51.44 76.83,51.12 52.39,51.12 51.75,50.48 v50.48,50.48
BR-TEST  (via drill 0.25)
  Top 0.127: IC15.9 83.19,26.04 v83.19,32.38
  Bottom 0.127: v83.19,32.38 83.5,32.7 107.63,32.7 IC29.2
BRANCH-LD-HI  (via drill 0.25)
  Top 0.127: IC13.9 127.32,9.21 127.32,12.38 130.81,15.88 130.81,60.33 129.86,61.28 v129.86,89.85
  Bottom 0.127: v129.86,89.85 128.27,91.44 103.19,91.44 98.42,96.2 90.49,96.2 89.53,95.25 77.47,95.25 76.2,93.98 IC26.11
BRANCH-LD-LO  (via drill 0.25)
  Top 0.127: IC13.5 115.89,9.84 115.89,23.18 116.2,23.5 116.2,27.94 115.89,28.26 115.89,50.8 v116.2,51.12 | v107.63,51.75 105.41,53.98 105.41,63.82 105.73,64.14 105.73,99.06 v105.41,99.38
  Bottom 0.127: v116.2,51.12 115.57,51.75 v107.63,51.75 | v105.41,99.38 98.42,106.36 90.49,106.36 89.85,105.73 74.61,105.73 IC27.11
BUS-LATCH-CLK  (via drill 0.25)
  Top 0.127: IC17.11 44.13,40.96 44.13,44.13 43.5,44.77 v43.5,70.8 43.5,105.73 IC16.11 | IC13.11 128.59,17.46 128.59,28.26 IC14.11 | IC15.11 87.31,23.18 87.31,45.72 88.9,47.31 IC19.11 87.31,56.2 87.31,67.94 | 87.31,67.94 v87,68.26 | IC20.11 87.95,85.41 87.95,78.42 87.31,77.79 87.31,67.94 | v100.65,22.54 v100.65,31.75 | IC18.11 v73.66,71.12
  Bottom 0.127: IC35.11 144.46,18.1 132.4,18.1 130.81,16.51 IC13.11 | IC18.11 73.98,68.26 v87,68.26 | IC14.11 127,31.75 101.6,31.75 101.28,31.43 100.97,31.43 v100.65,31.75 | v100.65,22.54 89.85,22.54 IC15.11 | v43.5,70.8 43.81,70.48 61.59,70.48 62.23,71.12 v73.66,71.12
CADDR0  (via drill 0.25)
  Top 0.127: IC2.16 143.19,53.66 143.19,46.04 v141.6,44.45 | v103.82,45.09 101.92,43.18 v101.92,39.05
  Bottom 0.127: v141.6,44.45 140.97,43.81 119.7,43.81 118.43,45.09 v103.82,45.09 | v101.92,39.05 99.69,36.83 SV4.14
CADDR1  (via drill 0.25)
  Top 0.127: v100.33,55.56 100.01,55.24 v100.01,34.92
  Bottom 0.127: IC2.14 145.1,56.83 111.12,56.83 110.49,56.2 110.17,56.2 109.86,56.52 104.14,56.52 103.82,56.83 101.6,56.83 v100.33,55.56 | v100.01,34.92 99.38,34.29 SV4.16
CADDR2  (via drill 0.25)
  Top 0.127: v99.69,59.05 99.06,58.42 99.06,36.51 98.74,36.2 98.74,32.7 SV4.18
  Bottom 0.127: IC2.12 149.86,57.15 110.81,57.15 108.27,59.69 100.33,59.69 v99.69,59.05
CADDR3  (via drill 0.25)
  Top 0.127: v107.31,37.15 105.41,35.24 v105.41,30.16
  Bottom 0.127: IC2.9 148.59,43.18 148.59,36.2 130.49,36.2 129.86,35.56 125.41,35.56 123.83,37.15 v107.31,37.15 | v105.41,30.16 104.46,29.21 SV4.20
CADDR4  (via drill 0.25)
  Top 0.127: v130.18,45.09 126.68,41.59 v126.68,37.47 | v103.82,34.92 102.55,33.66 v102.55,27.3
  Bottom 0.127: IC2.7 145.41,45.09 134.62,45.09 134.3,44.77 130.49,44.77 v130.18,45.09 | v126.68,37.47 126.36,37.78 106.68,37.78 v103.82,34.92 | v102.55,27.3 101.92,26.67 SV4.22
CADDR5  (via drill 0.25)
  Top 0.127: IC1.18 136.53,41.27 v136.53,39.37 | v99.38,36.2 99.06,35.88 99.06,25.4 SV4.24
  Bottom 0.127: v136.53,39.37 135.25,38.1 102.23,38.1 100.33,36.2 v99.38,36.2
CADDR6  (via drill 0.25)
  Route2 0.127: v106.36,38.73 106.36,37.15 104.46,35.24 104.46,29.84 99.38,24.77 99.38,23.5 97.79,21.91 SV4.26
  Bottom 0.127: IC1.16 143.83,43.5 147.64,43.5 148.27,42.86 148.27,40.01 130.49,40.01 129.86,40.64 122.56,40.64 120.65,38.73 v106.36,38.73
CADDR7  (via drill 0.25)
  Top 0.127: v130.18,40.96 127.95,40.96 v127.95,22.86
  Bottom 0.127: IC1.14 145.73,40.32 130.81,40.32 v130.18,40.96 | v127.95,22.86 127.95,18.41 98.42,18.41 SV4.28
CADDR8  (via drill 0.25)
  Top 0.127: IC1.12 153.35,40.96 153.35,30.8 152.4,29.84 152.4,8.26 v150.5,6.35 | v104.14,6.35 100.01,10.48 v100.01,16.19
  Bottom 0.127: v104.14,6.35 v150.5,6.35 | v100.01,16.19 99.69,16.51 SV4.30
CADDR9  (via drill 0.25)
  Top 0.127: IC1.9 150.18,32.07 v150.18,13.97 | v105.73,12.06 106.05,11.75 106.05,10.16 105.73,9.84 105.73,7.3 103.82,5.4 96.84,5.4 96.84,13.02 SV4.32
  Bottom 0.127: v150.18,13.97 147.32,11.11 137.16,11.11 136.21,10.16 135.57,10.16 133.67,12.06 v105.73,12.06
CADDR10  (via drill 0.25)
  Top 0.127: v136.53,29.21 132.4,25.08 v132.4,10.16
  Bottom 0.127: IC1.7 144.15,31.11 138.43,31.11 v136.53,29.21 | v132.4,10.16 132.08,10.48 104.78,10.48 104.46,10.16 102.87,10.16 101.6,11.43 SV4.34
CADDR11  (via drill 0.25)
  Top 0.127: v102.55,34.29 101.92,33.66 101.92,23.18 100.33,21.59 100.33,18.41 98.74,16.83 98.74,9.84 SV4.36
  Bottom 0.127: IC1.5 140.34,32.38 125.41,32.38 125.09,32.07 123.83,32.07 122.87,33.02 122.56,33.02 122.24,32.7 111.44,32.7 110.17,33.97 110.17,35.88 105.41,35.88 103.82,34.29 v102.55,34.29
CADDR12  (via drill 0.25)
  Top 0.127: IC1.3 136.53,33.66 v136.53,31.75 | v106.36,26.35 105.41,25.4 105.41,19.05 103.19,16.83 99.38,16.83 99.38,7.94 SV4.38
  Bottom 0.127: v136.53,31.75 131.44,26.67 107.63,26.67 107.31,26.99 107,26.99 v106.36,26.35
CNT-CLK
  Top 0.127: IC35.13 139.38,14.92 137.16,14.92 137.16,30.48 135.89,31.75 135.89,53.34 IC2.18
COUNT-FAULT  (via drill 0.25)
  Top 0.127: IC2.5 141.29,47.94 141.29,60.64 141.92,61.28 v141.92,68.26 | v114.94,71.44 110.81,71.44 110.81,81.6 IC10.12
  Bottom 0.127: v141.92,68.26 133.03,68.26 131.76,69.53 131.76,71.44 116.52,71.44 116.2,71.12 115.25,71.12 v114.94,71.44
COUNT-RESET
  Top 0.127: IC10.3 113.03,76.2 113.03,92.08 115.89,94.93 115.89,96.84 124.46,105.41 133.03,105.41 | 133.03,105.41 134.62,105.41 IC6.14 | IC5.14 132.4,83.5 132.4,100.01 133.03,100.65 133.03,105.41
DATA0  (via drill 0.25)
  Top 0.127: IC27.3 55.88,96.84 56.83,95.89 56.83,87.31 IC26.3 v55.88,84.14 | IC34.3 27.94,85.09 27.94,84.14 | 27.94,84.14 27.94,44.13 26.67,42.86 26.04,42.86 26.04,45.09 IC25.3 26.67,46.99 v25.72,47.94 | X1.A19 4.13,62.55 v4.13,54.29 | IC28.3 51.12,9.21 51.12,16.19 54.29,19.37 54.29,44.77 IC9.2 | 27.94,84.14 v27.62,84.14
  Bottom 0.127: IC27.3 IC27.2 | IC28.3 IC28.2 | IC25.3 28.26,44.13 51.75,44.13 IC9.2 | v4.13,54.29 4.13,49.21 16.51,49.21 18.73,46.99 20.32,46.99 21.27,47.94 v25.72,47.94 | v55.88,84.14 55.56,84.45 27.94,84.45 v27.62,84.14
DATA1  (via drill 0.25)
  Top 0.127: IC28.4 IC28.5 58.1,11.11 58.1,16.83 57.47,17.46 57.47,44.77 IC9.4 57.47,46.67 v57.47,71.12 57.47,83.19 v57.78,83.5 58.42,84.14 IC26.4 58.42,90.81 60.01,92.39 60.01,99.06 | IC25.4 30.16,44.77 v30.16,43.5 | IC27.5 60.01,99.06 | 60.01,99.06 IC27.4 | IC34.4 29.53,86.04 v29.53,83.82
  Bottom 0.127: v30.16,43.5 30.48,43.81 56.52,43.81 IC9.4 | v29.53,83.82 29.84,84.14 55.24,84.14 55.88,83.5 v57.78,83.5 | X1.A20 5.08,67.63 4.45,67.63 4.13,67.94 4.13,70.17 20.64,70.17 21.27,70.8 42.86,70.8 43.5,71.44 57.15,71.44 v57.47,71.12
DATA2  (via drill 0.25)
  Top 0.127: IC27.7 66.99,98.11 66.99,87.31 IC26.7 65.41,85.72 v65.41,83.5 | IC28.7 58.42,7.62 | 58.42,7.62 IC28.6 | 35.56,83.5 35.56,85.09 IC34.7 | 35.56,83.5 v35.56,70.17 35.56,46.99 IC25.7 36.83,43.81 v37.47,43.18 | 58.42,7.62 58.42,17.14 57.78,17.78 57.78,30.48 59.69,32.38 59.69,53.98 60.96,55.24 62.87,55.24 62.87,54.61 62.55,54.29 62.55,46.67 IC9.6 | 35.56,83.5 v38.73,83.5
  Bottom 0.127: IC27.7 IC27.6 | IC9.6 61.28,43.5 37.78,43.5 v37.47,43.18 | X1.A21 6.03,69.53 20.64,69.53 21.27,70.17 v35.56,70.17 | v65.41,83.5 64.77,82.87 53.34,82.87 52.7,83.5 v38.73,83.5
DATA3  (via drill 0.25)
  Top 0.127: IC28.8 IC28.9 65.72,8.57 65.72,31.43 64.77,32.38 v64.77,42.23 | IC25.8 39.69,45.4 v39.69,42.86 | IC34.8 38.42,87.31 38.42,103.82 40.96,106.36 40.96,108.58 42.86,110.49 67.63,110.49 67.63,100.01 | IC27.8 67.63,100.01 | 67.63,100.01 67.63,87.31 IC26.8 68.58,72.39 v67.94,71.75 67.31,71.12 67.31,56.52 67.63,56.2 67.63,46.67 IC9.8
  Bottom 0.127: v39.69,42.86 40.01,43.18 64.77,43.18 | 64.77,43.18 66.04,43.18 IC9.8 | 64.77,43.18 v64.77,42.23 | IC27.8 IC27.9 | X1.A22 6.03,72.07 12.06,72.07 13.02,71.12 42.55,71.12 43.18,71.75 v67.94,71.75
DATA4  (via drill 0.25)
  Top 0.127: IC27.12 69.22,106.68 | 69.22,106.68 IC27.13 | 69.22,106.68 69.22,100.33 69.53,100.01 69.53,94.93 IC26.13 69.53,93.03 69.53,78.42 69.22,78.11 69.22,69.85 69.53,69.53 69.53,58.1 69.22,57.78 v69.22,54.93 | IC28.12 63.18,15.24 | 63.18,15.24 IC28.13 | 63.18,15.24 63.18,31.43 62.23,32.38 v62.23,54.61
  Bottom 0.127: IC34.13 40.96,95.57 66.99,95.57 IC26.13 | 40.96,54.93 IC25.13 | 62.23,54.93 v69.22,54.93 72.07,54.93 IC9.11 | 62.23,54.93 40.96,54.93 | X1.A23 4.45,73.03 3.49,73.03 3.49,54.93 40.96,54.93 | 62.23,54.93 v62.23,54.61
DATA5  (via drill 0.25)
  Top 0.127: IC25.14 37.47,53.98 v37.47,56.2 | v67.94,56.52 68.58,55.88 IC9.13 | IC28.15 57.15,56.2 v56.83,56.52 56.83,72.07 57.15,72.39 57.15,96.2 v56.83,96.52 | IC27.14 65.09,106.68 | 65.09,106.68 IC27.15 | 65.09,106.68 65.09,94.93 IC26.14
  Bottom 0.127: IC28.14 IC28.15 | v37.47,56.2 37.78,55.88 50.16,55.88 50.8,56.52 v56.83,56.52 v67.94,56.52 | 38.42,95.57 39.05,96.2 56.83,96.2 | 38.42,95.57 IC34.14 | 56.83,96.2 58.74,96.2 59.37,96.84 67.63,96.84 69.53,94.93 69.53,92.39 67.63,92.39 IC26.14 | X1.A24 3.81,77.47 3.81,82.87 5.71,82.87 6.03,83.19 6.03,85.41 3.49,85.41 2.22,86.68 2.22,93.03 18.73,93.03 21.27,95.57 38.42,95.57 | 56.83,96.2 v56.83,96.52
DATA6  (via drill 0.25)
  Top 0.127: IC26.17 57.47,94.93 57.47,96.2 | 57.47,96.2 57.47,105.73 IC27.17 IC27.16 | IC28.17 IC28.16 v54.61,55.56 | IC25.17 28.26,54.29 28.26,55.56 | 28.26,55.56 28.26,93.03 IC34.17 | IC9.15 63.18,53.66 v63.18,55.56 | 28.26,55.56 v29.21,55.56 | X1.A25 3.81,80.01 3.81,91.76 v4.13,92.08 | v59.37,96.2 57.47,96.2
  Bottom 0.127: v63.18,55.56 62.87,55.24 54.61,55.24 | 54.61,55.24 29.53,55.24 v29.21,55.56 | v4.13,92.08 4.76,92.71 20.95,92.71 21.27,92.39 27.62,92.39 IC34.17 31.43,91.76 37.78,91.76 37.78,94.3 39.37,95.89 59.05,95.89 v59.37,96.2 | 54.61,55.24 v54.61,55.56
DATA7  (via drill 0.25)
  Top 0.127: IC27.18 54.93,106.68 | 54.93,106.68 IC27.19 | IC26.18 54.93,94.93 54.93,96.84 | 54.93,106.68 54.93,96.84 | IC25.18 25.4,54.61 25.4,56.83 | 25.4,56.83 v25.4,82.87 25.4,92.71 IC34.18 26.67,95.89 v27.62,96.84 | v58.42,57.15 IC9.17 | 25.4,56.83 v26.99,56.83 | IC28.18 49.53,40.96 49.85,41.27 v49.85,56.52 | v55.24,96.84 54.93,96.84
  Bottom 0.127: IC28.18 IC28.19 | 49.85,57.15 47.31,57.15 46.35,56.2 40.64,56.2 39.69,57.15 31.43,57.15 31.11,56.83 v26.99,56.83 | 49.85,57.15 v58.42,57.15 | X1.A26 6.03,82.23 20.64,82.23 21.27,82.87 v25.4,82.87 | 49.85,57.15 v49.85,56.52 | v55.24,96.84 54.93,96.52 27.94,96.52 v27.62,96.84
DATA8  (via drill 0.25)
  Top 0.127: IC25.2 25.08,46.67 25.08,70.48 v23.5,72.07
  Route2 0.127: IC26.2 39.05,72.07 v23.5,72.07
  Bottom 0.127: v23.5,72.07 13.34,72.07 10.48,74.93 4.76,74.93 3.49,76.2 3.49,83.82 X1.A27
DATA9  (via drill 0.25)
  Top 0.127: IC25.5 32.07,46.04 32.07,51.75 32.7,52.39 32.7,57.78 34.29,59.37 35.24,59.37 35.24,69.85 33.02,72.07 33.02,84.77 v32.7,85.09
  Bottom 0.127: 33.02,84.77 v32.7,85.09 | 33.02,84.77 59.37,84.77 IC26.5 | X1.A28 6.03,87.31 11.11,87.31 12.06,86.36 19.68,86.36 21.27,84.77 33.02,84.77
DATA10  (via drill 0.25)
  Top 0.127: IC25.6 33.34,46.67 v33.34,57.78 | v61.28,58.74 62.23,59.69 62.23,85.09 IC26.6 | v13.65,87.95 13.34,87.63 13.34,59.05 v13.97,58.42
  Bottom 0.127: 33.66,58.1 v33.34,57.78 | 33.66,58.1 57.47,58.1 57.78,58.42 60.96,58.42 v61.28,58.74 | X1.A29 6.03,87.95 v13.65,87.95 | v13.97,58.42 14.29,58.1 33.66,58.1
DATA11  (via drill 0.25)
  Top 0.127: v44.13,47.94 45.4,49.21 45.4,65.41 45.09,65.72 45.09,67.31 45.4,67.63 v45.4,79.06 | v70.48,82.87 71.12,83.5 IC26.9 | X1.A30 4.13,90.49 4.13,80.64 v4.76,80.01
  Route2 0.127: v44.13,47.94 IC25.9
  Bottom 0.127: 46.04,79.69 46.67,80.33 49.85,80.33 50.48,79.69 67.31,79.69 v70.48,82.87 | 46.04,79.69 v45.4,79.06 | v4.76,80.01 5.08,80.33 20.64,80.33 21.27,79.69 46.04,79.69
DATA12  (via drill 0.25)
  Top 0.127: v40.32,35.24 40.32,51.75 IC25.12 41.91,56.52 v42.23,56.83 | IC26.12 69.85,92.71 69.85,78.11 69.53,77.79 69.53,70.17 69.85,69.85 v69.85,57.78
  Bottom 0.127: v40.32,35.24 39.69,34.61 20.32,34.61 17.46,31.75 7.3,31.75 6.67,31.11 6.67,22.86 X1.B3 | v69.85,57.78 58.42,57.78 58.1,57.47 46.99,57.47 46.35,56.83 v42.23,56.83
DATA13  (via drill 0.25)
  Top 0.127: v35.24,37.47 35.24,46.67 34.29,47.62 IC25.15 34.29,58.42 v34.61,58.74 | v7.94,36.83 6.67,36.83 6.67,26.35 X1.B4 | IC26.15 61.91,92.39 61.91,60.01 v61.28,59.37
  Bottom 0.127: v35.24,37.47 34.92,37.15 19.68,37.15 19.37,36.83 v7.94,36.83 | v61.28,59.37 60.64,58.74 57.47,58.74 57.15,58.42 34.92,58.42 v34.61,58.74
DATA14  (via drill 0.25)
  Top 0.127: IC25.16 31.43,53.02 v31.43,51.12 | v9.21,51.44 8.57,50.8 8.57,28.89 X1.B5 | IC26.16 60.96,88.27 59.69,87 v59.69,59.69 | v36.2,59.05 35.88,58.74 35.88,51.12 v36.2,50.8
  Bottom 0.127: v9.21,51.44 9.84,52.07 19.37,52.07 20,51.44 31.11,51.44 v31.43,51.12 32.07,50.48 35.88,50.48 v36.2,50.8 | v59.69,59.69 59.05,59.05 57.15,59.05 56.83,58.74 36.51,58.74 v36.2,59.05
DATA15  (via drill 0.25)
  Top 0.127: IC25.19 23.5,52.7 23.5,50.16 | 23.5,50.16 23.5,46.99 22.54,46.04 v22.54,31.75 | IC26.19 54.29,93.03 54.29,56.52 51.75,53.98 v51.75,51.12 | 23.5,50.16 v24.45,50.16
  Bottom 0.127: v22.54,31.75 22.23,31.43 9.53,31.43 8.57,30.48 X1.B6 | v51.75,51.12 51.44,51.44 49.21,51.44 48.58,52.07 45.72,52.07 43.81,50.16 v24.45,50.16
DO-HALT
  Bottom 0.127: IC22.9 64.77,82.55 65.41,82.55 66.36,83.5 103.82,83.5 106.36,80.96 107.63,80.96 IC10.13
DO-INT  (via drill 0.25)
  Top 0.127: IC12.8 35.24,28.89 v35.24,30.48 | v50.8,30.48 52.07,31.75 52.07,44.45 IC9.1 52.39,47.31 52.39,52.39 IC9.19 53.34,54.93 54.61,56.2 54.61,82.23 v56.52,84.14
  Bottom 0.127: v50.8,30.48 v35.24,30.48 | IC11.1 105.41,86.36 90.81,86.36 89.85,85.41 79.69,85.41 79.38,85.72 74.93,85.72 73.34,84.14 v56.52,84.14
EXTERNAL-SINGLESTEP-CLK
  Top 0.127: EXT-SS-CLK.2 175.9,46.35 175.9,55.24 SS-SEL.3
FP-CLKH  (via drill 0.25)
  Top 0.127: v156.84,30.48 157.16,30.8 157.16,53.02 167.96,63.82 167.96,102.55 STEP-CLK.3
  Bottom 0.127: IC31.12 145.41,27.3 153.67,27.3 v156.84,30.48 | R4.1 153.67,105.41 165.1,105.41 STEP-CLK.3
FP-CLKL  (via drill 0.25)
  Top 0.127: v158.12,31.75 168.28,31.75 168.28,107.31 STEP-CLK.1
  Bottom 0.127: IC31.8 155.26,30.8 156.53,30.8 157.48,31.75 v158.12,31.75 | R5.2 163.83,109.22 STEP-CLK.1
FP-EXECUTE  (via drill 0.25)
  Top 0.127: IC23.6 118.43,47.94 118.43,71.75 v120.02,73.34 | R6.1 164.78,86.68 164.78,75.25 RESET.3
  Bottom 0.127: v120.02,73.34 166.05,73.34 RESET.3
FP-FREERUN  (via drill 0.25)
  Top 0.127: IC31.2 141.29,21.27 v141.29,19.37 | R3.2 166.37,96.52 SS/WAIT.1
  Bottom 0.127: v141.29,19.37 142.24,18.41 165.1,18.41 165.74,17.78 175.58,17.78 176.85,19.05 176.85,92.71 167.64,92.71 SS/WAIT.1
FP-HALT  (via drill 0.25)
  Top 0.127: IC12.12 25.08,26.99 v25.08,25.4 | v64.45,24.13 64.77,23.81 IC36.2
  Bottom 0.127: v25.08,25.4 26.04,24.45 37.47,24.45 37.78,24.13 48.58,24.13 48.9,24.45 59.05,24.45 59.37,24.13 v64.45,24.13
FP-HALT-CONT  (via drill 0.25)
  Top 0.127: IC36.8 77.79,28.26 v77.79,53.34
  Bottom 0.127: v77.79,53.34 103.19,53.34 103.5,53.66 105.73,53.66 106.36,53.02 110.17,53.02 IC23.12
FP-RESET  (via drill 0.25)
  Top 0.127: IC23.2 109.54,47.31 v109.54,49.21 | v124.46,49.21 126.36,51.12 126.36,75.56 v127.32,76.52 | R7.2 164.47,90.81 164.47,87.63 166.37,85.72 RESET.1
  Bottom 0.127: v124.46,49.21 v109.54,49.21 | v127.32,76.52 129.54,78.74 RESET.1
FP-SINGLE-STEP-CLK
  Bottom 0.127: IC31.11 IC31.10 150.18,27.62 152.08,27.62 152.08,29.53 153.67,31.11 155.89,31.11 155.89,33.97 SS-SEL.1
FP-SS
  Top 0.127: R2.1 164.78,94.3 164.78,90.49 SS/WAIT.3
  Bottom 0.127: IC31.6 162.24,32.7 173.99,32.7 176.53,35.24 176.53,87.63 167.64,87.63 SS/WAIT.3
FREE-RUN  (via drill 0.25)
  Top 0.127: IC31.4 145.1,21.59 | 145.1,21.59 IC31.3 | v144.15,97.16 148.59,92.71 148.59,31.11 149.54,30.16 149.54,15.56 148.91,14.92 145.1,14.92 145.1,21.59
  Bottom 0.127: IC7.10 140.34,97.16 v144.15,97.16
GND
  pour Route15: 1.27,113.03 176.53,113.03 176.53,1.27 1.27,1.27
HALT-CLR  (via drill 0.25)
  Top 0.127: IC22.13 53.66,80.96 v53.66,76.52 | v100.33,59.05 v100.33,75.56 | v106.05,59.05 109.22,55.88 IC23.13
  Bottom 0.127: v53.66,76.52 53.98,76.2 99.69,76.2 v100.33,75.56 | v106.05,59.05 v100.33,59.05
HARD-RESET1
  Bottom 0.127: IC31.13 142.56,30.8 149.54,30.8 IC31.9
INT-EDGE  (via drill 0.25)
  Top 0.127: IC22.3 54.93,72.71 54.93,66.36 v56.2,65.09 | v58.1,64.45 59.37,63.18 59.37,60.01 59.05,59.69 59.05,54.61 59.37,54.29 59.37,38.42 v59.05,38.1 | v90.49,36.2 92.39,34.29 92.39,7.62 95.25,4.76 100.01,4.76 100.33,5.08 v104.46,5.08
  Bottom 0.127: v56.2,65.09 56.83,64.45 v58.1,64.45 | v59.05,38.1 59.37,37.78 82.55,37.78 84.45,35.88 90.17,35.88 v90.49,36.2 | v104.46,5.08 146.05,5.08 JP1.2
INT-EN  (via drill 0.25)
  Top 0.127: v93.98,19.68 v93.03,18.73 | v123.51,27.3 v123.51,20
  Bottom 0.127: IC21.6 54.93,18.73 v93.03,18.73 | v93.98,19.68 94.3,20 98.42,20 98.74,19.68 123.19,19.68 v123.51,20 | v123.51,27.3 123.83,27.62 125.41,27.62 IC14.12
INT-LD-HI  (via drill 0.25)
  Top 0.127: v108.58,43.5 108.27,43.18 108.27,27.3 v109.54,26.04 | v118.75,26.04 119.38,25.4 IC14.6
  Route15 0.127: IC25.11 46.35,51.44 v46.35,46.04
  Bottom 0.127: v46.35,46.04 46.67,46.35 49.53,46.35 50.8,47.62 76.2,47.62 80.64,43.18 103.19,43.18 103.5,43.5 v108.58,43.5 | v118.75,26.04 v109.54,26.04
INT-LD-LO  (via drill 0.25)
  Top 0.127: v118.75,13.97 119.38,14.61 IC13.15
  Bottom 0.127: IC28.11 68.58,13.97 73.03,13.97 73.98,13.02 103.5,13.02 103.82,12.7 105.09,12.7 106.36,13.97 v118.75,13.97
INT-START  (via drill 0.25)
  Top 0.127: IC14.9 126.05,22.54 126.05,45.09 128.27,47.31 128.27,62.87 v129.22,63.82 | v142.56,66.67 143.51,67.63 IC24.9
  Bottom 0.127: v129.22,63.82 132.08,66.67 v142.56,66.67
IO-ADDR0  (via drill 0.25)
  Top 0.127: v12.06,32.38 13.97,30.48 v13.97,18.41 | v63.82,16.51 63.82,31.43 64.45,32.07 64.45,41.91 64.14,42.23 64.14,44.45 64.45,44.77 64.45,69.85 64.14,70.17 64.14,72.39 64.45,72.71 64.45,88.9 v63.82,89.53
  Bottom 0.127: IC39.9 154.94,63.5 161.93,63.5 165.1,66.67 165.1,69.85 168.28,73.03 168.28,77.47 167.96,77.47 | IC39.18 167.96,77.47 | X1.C7 10.79,32.38 v12.06,32.38 | v13.97,18.41 18.73,13.65 40.64,13.65 41.27,14.29 43.5,14.29 44.13,13.65 62.55,13.65 63.82,14.92 v63.82,16.51 | v63.82,89.53 80.01,89.53 80.33,89.85 90.81,89.85 91.76,88.9 105.09,88.9 105.73,89.53 124.78,89.53 125.41,88.9 127.64,88.9 127.95,89.22 150.5,89.22 158.75,80.96 166.05,80.96 167.96,79.06 167.96,77.47
IO-ADDR1  (via drill 0.25)
  Top 0.127: 156.21,69.85 156.84,70.48 156.84,77.47 160.34,80.96 162.88,80.96 162.88,73.98 IC39.16 | 156.21,69.85 IC39.7 | v14.29,34.92 20,29.21 v20,13.02 | v100.65,12.38 103.5,12.38 103.82,12.7 v105.73,12.7 | v155.89,14.61 156.21,14.92 156.21,69.85
  Bottom 0.127: X1.C8 10.79,34.92 v14.29,34.92 | v20,13.02 21.59,11.43 73.34,11.43 74.3,12.38 v100.65,12.38 | v105.73,12.7 106.05,12.38 135.25,12.38 135.57,12.7 148.27,12.7 150.18,14.61 v155.89,14.61
IO-ADDR2  (via drill 0.25)
  Top 0.127: IC39.14 v158.43,70.17 | X1.C9 11.11,37.15 11.11,19.68 17.78,13.02 v17.78,12.7 | v85.41,11.75 85.41,31.75 87,33.34 87,46.04 88.27,47.31 v88.27,50.48 | v149.54,50.8 151.13,52.39 151.13,69.85 IC39.5
  Bottom 0.127: IC39.5 155.89,70.17 v158.43,70.17 | v17.78,12.7 20.64,9.84 40.64,9.84 41.59,8.89 42.23,8.89 42.86,9.53 70.17,9.53 70.8,8.89 71.44,8.89 74.3,11.75 v85.41,11.75 | v88.27,50.48 88.9,51.12 100.97,51.12 103.82,48.26 104.46,48.26 106.36,50.16 128.59,50.16 129.22,50.8 v149.54,50.8
IO-ADDR3  (via drill 0.25)
  Top 0.127: IC39.12 157.8,65.72 v157.8,73.98 | v44.77,38.1 45.72,39.05 v45.72,65.72
  Route15 0.127: v45.72,65.72 46.99,66.99 74.61,66.99 84.14,76.52 v84.14,76.83
  Bottom 0.127: v157.8,73.98 154.31,77.47 IC39.3 128.91,77.47 127.32,75.88 125.73,75.88 125.09,76.52 106.36,76.52 106.05,76.2 103.82,76.2 103.5,76.52 84.45,76.52 v84.14,76.83 | X1.C10 11.43,39.37 20.95,39.37 22.23,38.1 v44.77,38.1
L-REG-LD-HI  (via drill 0.25)
  Top 0.127: IC12.5 30.8,21.91 35.88,21.91 v35.88,16.51 | v75.56,13.65 80.33,13.65 80.33,18.73 83.82,22.23 v83.82,39.69 | v90.17,40.96 90.49,41.27 90.49,63.18 IC19.15
  Bottom 0.127: v35.88,16.51 36.2,16.83 63.18,16.83 63.82,17.46 67.94,17.46 68.58,16.83 73.98,16.83 75.25,15.56 75.25,13.65 v75.56,13.65 | v83.82,39.69 85.09,40.96 v90.17,40.96
L-REG-LD-LO  (via drill 0.25)
  Top 0.127: v106.05,57.47 108.27,55.24 108.27,44.45 109.22,43.5 IC29.13
  Bottom 0.127: IC19.9 82.23,58.1 93.98,58.1 94.61,57.47 v106.05,57.47
LD-INS-REG  (via drill 0.25)
  Top 0.127: IC12.1 18.1,19.37 18.1,13.02 22.54,8.57 v22.54,6.03 | v113.67,4.45 116.52,7.3 118.11,7.3 118.11,27.94 IC14.15
  Bottom 0.127: v22.54,6.03 24.77,3.81 93.66,3.81 94.61,2.86 99.38,2.86 100.97,4.45 v113.67,4.45
LD-INS-REG1  (via drill 0.25)
  Top 0.127: v105.09,71.44 105.41,71.12 105.41,64.45 103.82,62.87 v103.82,56.2 | v65.41,55.56 65.09,55.24 v65.09,52.07 | v32.7,51.12 33.02,50.8 33.02,36.2 35.88,33.34 35.88,22.54 36.83,21.59 IC3.9
  Bottom 0.127: IC12.3 27.62,16.83 34.92,16.83 36.51,15.24 IC3.9 | IC4.9 122.87,68.26 108.9,68.26 107.63,69.53 107.63,71.44 v105.09,71.44 | v103.82,56.2 102.55,54.93 90.49,54.93 89.85,55.56 79.38,55.56 79.06,55.24 69.53,55.24 69.22,55.56 v65.41,55.56 | v65.09,52.07 64.77,51.75 49.53,51.75 48.9,52.39 45.4,52.39 44.13,51.12 37.15,51.12 36.83,51.44 33.02,51.44 v32.7,51.12
LIO-ADDR0  (via drill 0.25)
  Route15 0.127: IC17.12 42.86,41.59 49.21,41.59 51.75,44.13 74.61,44.13 v94.3,63.82
  Bottom 0.127: v94.3,63.82 94.61,63.5 106.05,63.5 106.68,64.14 126.68,64.14 132.08,58.74 160.34,58.74 IC39.11
LIO-ADDR1  (via drill 0.25)
  Route15 0.127: IC17.15 35.88,39.05 47.31,39.05 51.44,43.18 77.79,43.18 87.63,53.02 93.98,53.02 95.25,54.29 97.79,54.29 105.09,61.59 105.09,62.55 v107.31,64.77
  Bottom 0.127: v107.31,64.77 107.63,64.45 127,64.45 128.27,63.18 129.86,63.18 130.49,63.82 160.34,63.82 IC39.13
LIO-ADDR2  (via drill 0.25)
  Route15 0.127: IC17.16 34.92,43.81 47.62,43.81 53.02,49.21 78.11,49.21 87.31,58.42 87.31,60.01 88.58,61.28 89.53,61.28 v94.61,66.36
  Bottom 0.127: v94.61,66.36 101.6,66.36 103.82,68.58 106.05,68.58 106.68,67.94 127.32,67.94 127.95,68.58 130.18,68.58 131.13,67.63 151.45,67.63 152.72,68.9 160.34,68.9 IC39.15
LIO-ADDR3  (via drill 0.25)
  Route15 0.127: IC17.19 26.35,42.86 33.34,42.86 34.61,44.13 47.31,44.13 52.7,49.53 72.07,49.53 81.28,58.74 81.6,58.74 85.09,62.23 85.09,63.5 v86.04,64.45
  Bottom 0.127: v86.04,64.45 87.63,66.04 93.98,66.04 94.3,65.72 103.5,65.72 103.82,66.04 130.81,66.04 132.08,67.31 151.76,67.31 153.03,68.58 163.19,68.58 167.96,73.34 167.96,74.93 IC39.17
LREG-LD-ID0  (via drill 0.25)
  Top 0.127: v49.53,69.53 51.75,71.75 51.75,77.47 51.44,77.79 51.44,80.01 51.75,80.33 51.75,96.2 49.85,98.11 v49.85,102.23 | v83.19,99.38 v83.19,102.87
  Bottom 0.127: IC32.11 45.4,69.53 v49.53,69.53 | v49.85,102.23 50.48,101.6 71.44,101.6 72.71,102.87 v83.19,102.87 | v83.19,99.38 83.5,99.06 IC20.16
LREG-LD-ID1  (via drill 0.25)
  Top 0.127: IC32.13 40.64,69.85 40.64,74.3 40.96,74.61 40.96,83.5 42.86,85.41 v42.86,97.16 | v87.31,97.79 87.31,105.09 IC20.19
  Bottom 0.127: v42.86,97.16 43.18,96.84 54.61,96.84 55.24,97.47 87,97.47 v87.31,97.79
LREG-LD-ID2  (via drill 0.25)
  Top 0.127: v82.55,71.44 82.87,71.75 82.87,73.34 IC19.2
  Bottom 0.127: IC32.15 35.24,69.53 35.88,69.53 36.51,70.17 61.91,70.17 62.55,70.8 73.34,70.8 73.66,70.48 78.42,70.48 79.38,71.44 v82.55,71.44
LREG-LD-ID3  (via drill 0.25)
  Top 0.127: v29.21,66.36 IC32.17
  Bottom 0.127: v29.21,66.36 46.99,66.36 47.94,67.31 50.16,67.31 50.48,66.99 80.96,66.99 IC19.5
LREG-RD-ID0  (via drill 0.25)
  Top 0.127: v37.47,65.72 38.42,66.67 38.42,78.42 40.32,80.33 40.32,92.08 v40.64,92.39
  Route2 0.127: IC32.2 28.89,65.72 v37.47,65.72
  Bottom 0.127: v40.64,92.39 47.62,92.39 47.94,92.71 50.16,92.71 50.48,92.39 60.01,92.39 60.33,92.71 60.96,92.08 71.12,92.08 72.71,93.66 72.71,96.52 IC20.6
LREG-RD-ID1  (via drill 0.25)
  Route15 0.127: IC32.4 35.88,67.63 35.88,68.9 46.99,80.01 v46.99,85.41
  Bottom 0.127: v46.99,85.41 46.99,87.63 48.58,87.63 49.85,88.9 IC20.9
LREG-RD-ID2
  Route15 0.127: IC32.6 39.69,66.36 45.72,66.36 51.44,72.07 67.63,72.07 80.33,84.77 84.77,84.77 IC20.12
LREG-RD-ID3  (via drill 0.25)
  Top 0.127: v75.56,62.55 75.88,62.87 75.88,74.3 76.2,74.61 v76.2,94.61
  Bottom 0.127: IC32.8 41.27,59.05 56.52,59.05 56.83,59.37 58.74,59.37 60.01,60.64 60.01,62.55 69.53,62.55 69.85,62.87 75.25,62.87 v75.56,62.55 | v76.2,94.61 77.15,95.57 87.95,95.57 IC20.15
N$1
  Top 0.127: IC5.5 139.38,75.88 139.38,100.01 138.75,100.65 138.75,108.27 IC6.12
N$2
  Route15 0.127: IC1.2 130.81,38.1 130.81,41.91 112.08,60.64 110.81,60.64 IC4.2
N$3  (via drill 0.25)
  Top 0.127: v125.09,32.7 123.51,34.29 123.51,60.64 IC4.7
  Bottom 0.127: IC1.4 138.11,32.7 v125.09,32.7
N$4  (via drill 0.25)
  Top 0.127: IC29.5 118.11,35.56 v118.11,81.6 | IC6.5 140.02,101.28 140.02,88.58 IC7.6
  Bottom 0.127: v118.11,81.6 118.11,84.45 137.79,84.45 IC7.6
N$5  (via drill 0.25)
  Top 0.127: IC8.18 56.83,41.59 56.83,52.39 IC9.18 | v71.44,59.37 70.48,58.42 70.48,54.61 70.17,54.29 v70.17,46.99
  Bottom 0.127: IC4.4 112.71,60.64 93.98,60.64 93.03,61.59 90.17,61.59 89.85,61.28 77.47,61.28 77.15,61.59 76.2,61.59 73.98,59.37 v71.44,59.37 | v70.17,46.99 70.17,42.23 65.41,42.23 64.77,41.59 64.45,41.59 63.82,42.23 57.47,42.23 IC8.18
N$6  (via drill 0.25)
  Top 0.127: IC8.16 61.91,41.59 61.91,50.48 | 61.91,50.48 61.91,52.39 IC9.16 | v93.66,60.33 91.44,58.1 v91.44,52.39 | 61.91,50.48 v61.59,50.48
  Bottom 0.127: IC4.5 114.94,60.33 v93.66,60.33 | v91.44,52.39 91.12,52.7 79.06,52.7 77.15,50.8 61.91,50.8 v61.59,50.48
N$7
  Top 0.127: IC2.2 133.67,47.94 133.67,59.69 134.62,60.64 IC6.3
N$8  (via drill 0.25)
  Top 0.127: v134.3,45.4 133.03,46.67 133.03,60.64 132.08,61.59 IC6.2
  Bottom 0.127: IC2.4 138.11,45.4 v134.3,45.4
N$9
  Top 0.127: IC2.6 143.83,47.94 143.83,60.64 144.46,61.28 144.46,96.2 142.24,98.42 IC6.6
N$10  (via drill 0.25)
  Top 0.127: v125.09,35.24 123.83,36.51 123.83,60.96 122.87,61.91 122.87,68.9 IC4.10
  Bottom 0.127: IC1.6 143.19,35.88 130.81,35.88 130.18,35.24 v125.09,35.24
N$11
  Top 0.127: IC2.8 148.91,47.94 148.91,97.47 IC6.7
N$12  (via drill 0.25)
  Top 0.127: IC5.3 134.3,73.98 134.3,60.96 v133.99,60.64
  Bottom 0.127: v133.99,60.64 162.24,60.64 162.88,60.01 162.88,54.61 IC2.11
N$13  (via drill 0.25)
  Top 0.127: IC2.13 149.54,54.93 v149.54,73.98
  Bottom 0.127: v149.54,73.98 147,76.52 132.4,76.52 IC5.2
N$14  (via drill 0.25)
  Top 0.127: v139.38,56.2 139.7,56.52 139.7,73.66 IC5.6
  Bottom 0.127: IC2.15 143.19,56.2 v139.38,56.2
N$15
  Top 0.127: IC2.17 140.02,54.93 140.02,71.44 IC5.7
N$16  (via drill 0.25)
  Top 0.127: IC36.6 76.2,21.59 76.2,35.88 75.88,36.2 75.88,59.05 v75.56,59.37 | v77.15,60.96 78.11,61.91 v78.11,98.74 | v119.38,98.42 127.32,98.42 127.32,88.58 IC7.1
  Bottom 0.127: v77.15,60.96 v75.56,59.37 | v78.11,98.74 79.69,100.33 83.19,100.33 83.82,99.69 87.63,99.69 87.95,100.01 93.98,100.01 94.93,99.06 104.14,99.06 104.78,98.42 v119.38,98.42
N$17  (via drill 0.25)
  Top 0.127: IC8.14 66.99,41.59 66.99,52.39 IC9.14 v66.04,58.74 | IC4.12 115.89,68.9 115.89,60.96 v116.2,60.64
  Bottom 0.127: v116.2,60.64 115.57,60.01 93.98,60.01 92.71,58.74 v66.04,58.74
N$18  (via drill 0.25)